# EAGLE design mainboard (EAGLE 5.04)

## Sheet 1 of 8
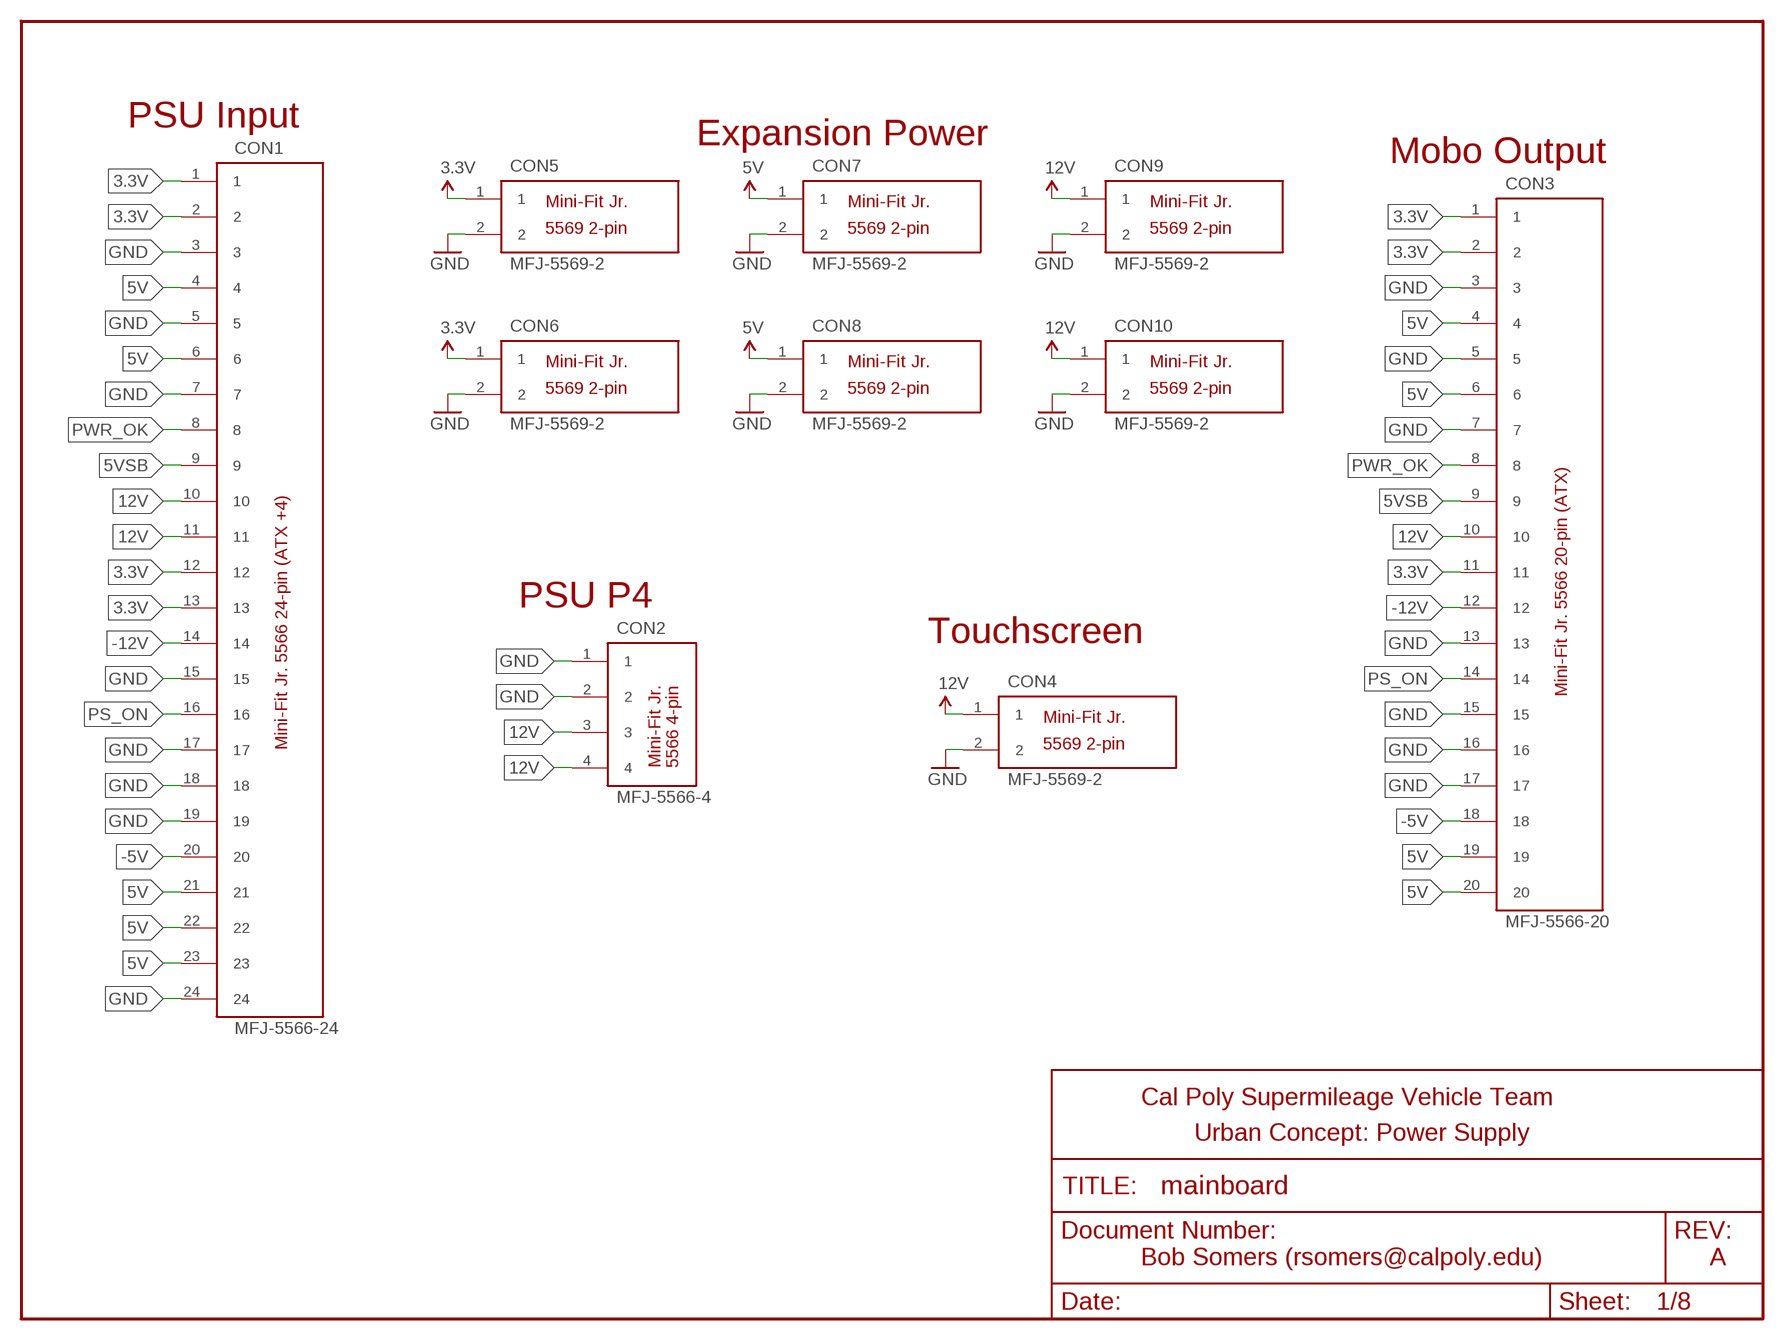
[diagram p0: schematic, sheet 1]

### Parts
CON1  MFJ-5566-24  [MFJ-5566-24]
CON2  MFJ-5566-4  [MFJ-5566-4]
CON3  MFJ-5566-20  [MFJ-5566-20]
CON4  MFJ-5569-2  [MFJ-5569-2]
CON5  MFJ-5569-2  [MFJ-5569-2]
CON6  MFJ-5569-2  [MFJ-5569-2]
CON7  MFJ-5569-2  [MFJ-5569-2]
CON8  MFJ-5569-2  [MFJ-5569-2]
CON9  MFJ-5569-2  [MFJ-5569-2]
CON10  MFJ-5569-2  [MFJ-5569-2]

### Nets
3.3V [3.3V Rail]: CON1.1 CON1.2 CON1.12 CON1.13 CON3.1 CON3.2 CON3.11 CON5.1 CON6.1 ; also sheet 2,3,4,5
5V [5V Rail]: CON1.4 CON1.6 CON1.21 CON1.22 CON1.23 CON3.4 CON3.6 CON3.19 CON3.20 CON7.1 CON8.1 ; also sheet 5
5VSB: CON1.9 CON3.9
12V [12V Rail]: CON1.10 CON1.11 CON2.3 CON2.4 CON3.10 CON4.1 CON9.1 CON10.1
-5V: CON1.20 CON3.18
-12V: CON1.14 CON3.12
GND [Ground]: CON1.3 CON1.5 CON1.7 CON1.15 CON1.17 CON1.18 CON1.19 CON1.24 CON2.1 CON2.2 CON3.3 CON3.5 CON3.7 CON3.13 CON3.15 CON3.16 CON3.17 CON4.2 CON5.2 CON6.2 CON7.2 CON8.2 CON9.2 CON10.2 ; also sheet 2,3,4,5,6
PS_ON: CON1.16 CON3.14
PWR_OK: CON1.8 CON3.8

### Notes on the sheet
- PSU Input
- Expansion Power
- Mobo Output
- PSU P4
- Touchscreen
- Cal Poly Supermileage Vehicle Team
- Urban Concept: Power Supply
- Bob Somers (rsomers@calpoly.edu) | A

## Sheet 2 of 8
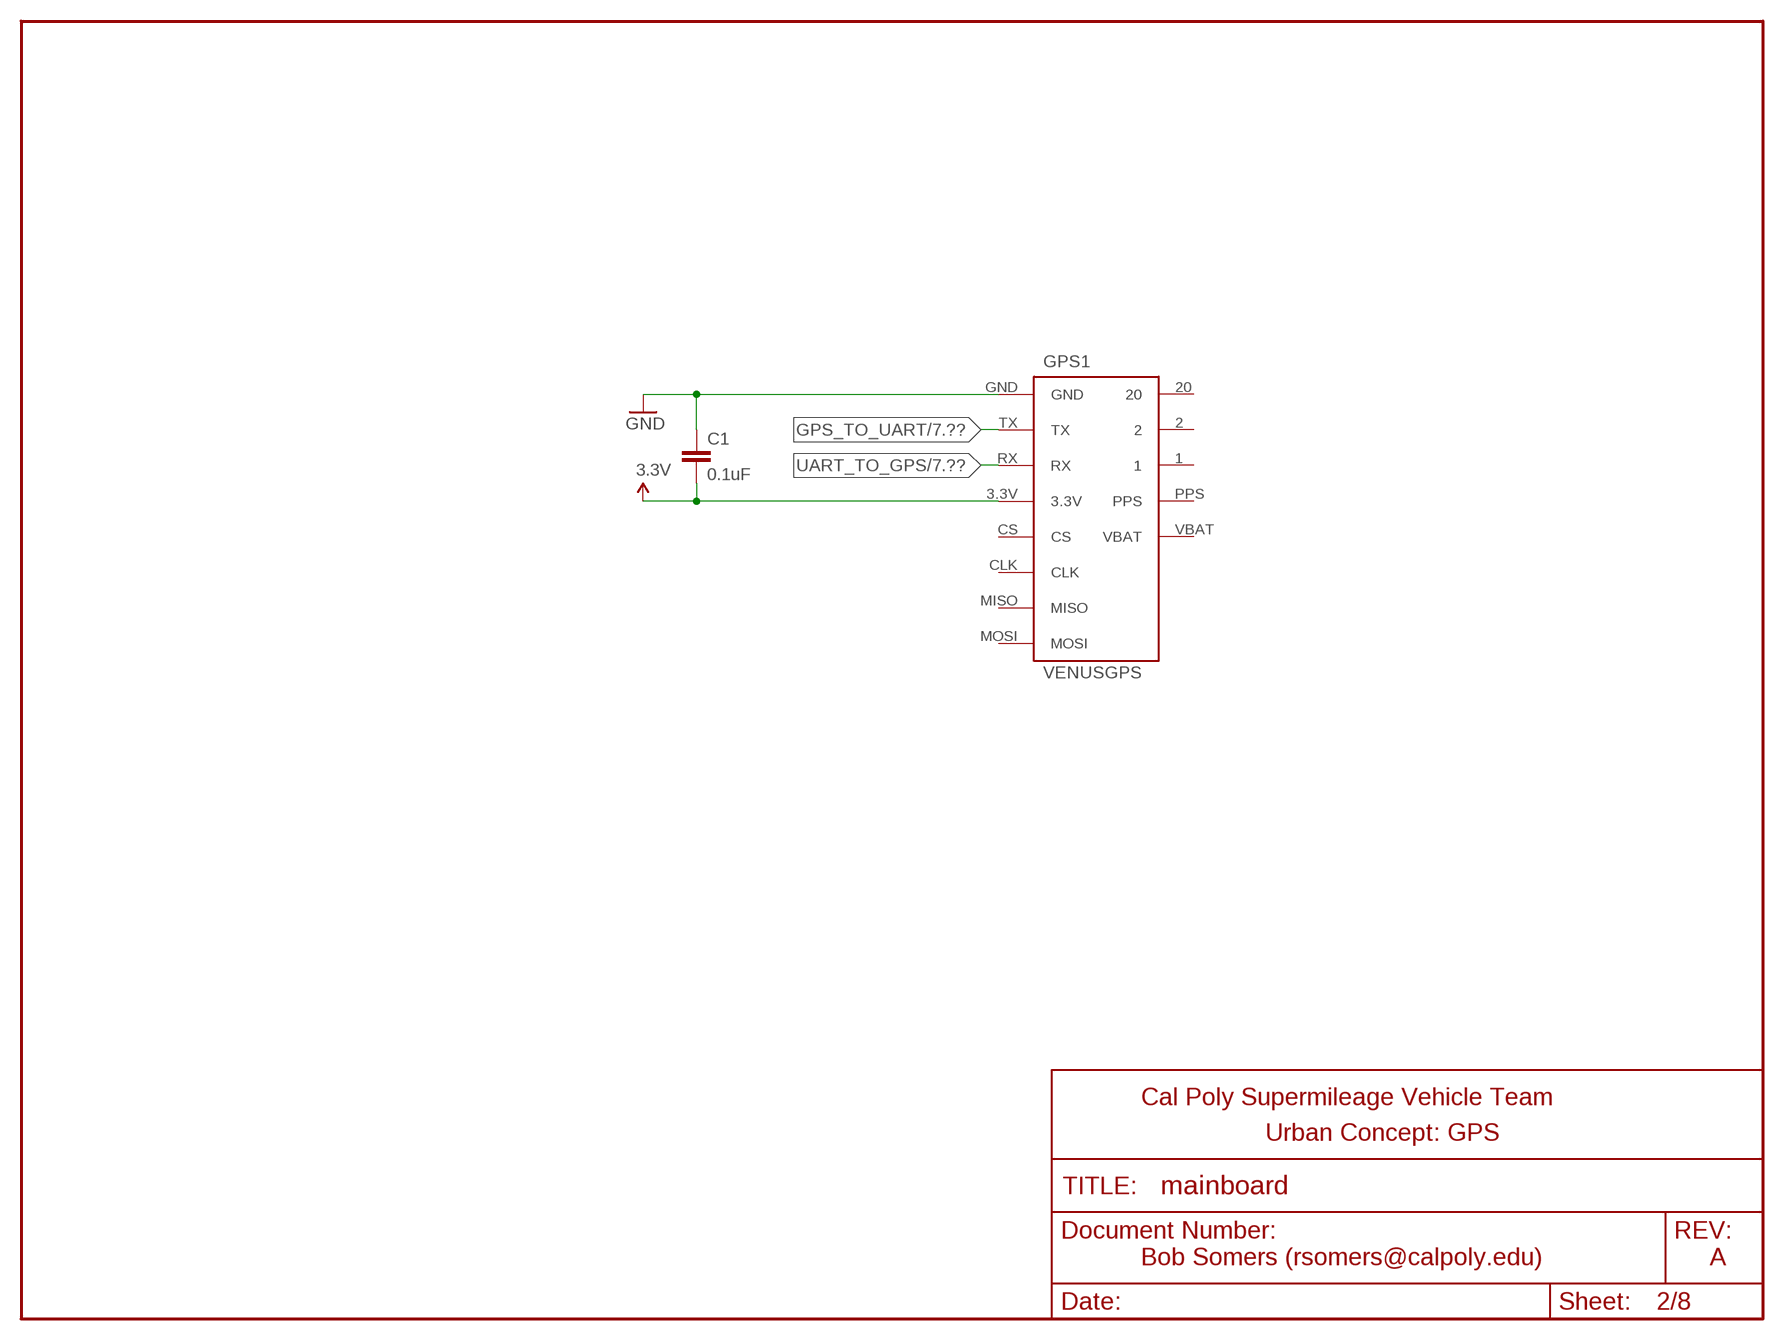
[diagram p1: schematic, sheet 2]

### Parts
C1  0.1uF  CAPPTH2  [CAP-PTH-SMALL2]
GPS1  VENUSGPS  [VENUSGPS]

### Nets
3.3V [3.3V Rail]: C1.2 GPS1.3.3V ; also sheet 1,3,4,5
GND [Ground]: C1.1 GPS1.GND ; also sheet 1,3,4,5,6
GPS_TO_UART: GPS1.TX ; also sheet 7
UART_TO_GPS: GPS1.RX ; also sheet 7
Unconnected: GPS1.1 GPS1.2 GPS1.20 GPS1.CLK GPS1.CS GPS1.MISO GPS1.MOSI GPS1.PPS GPS1.VBAT

### Notes on the sheet
- Cal Poly Supermileage Vehicle Team
- Urban Concept: GPS
- Bob Somers (rsomers@calpoly.edu) | A

## Sheet 3 of 8
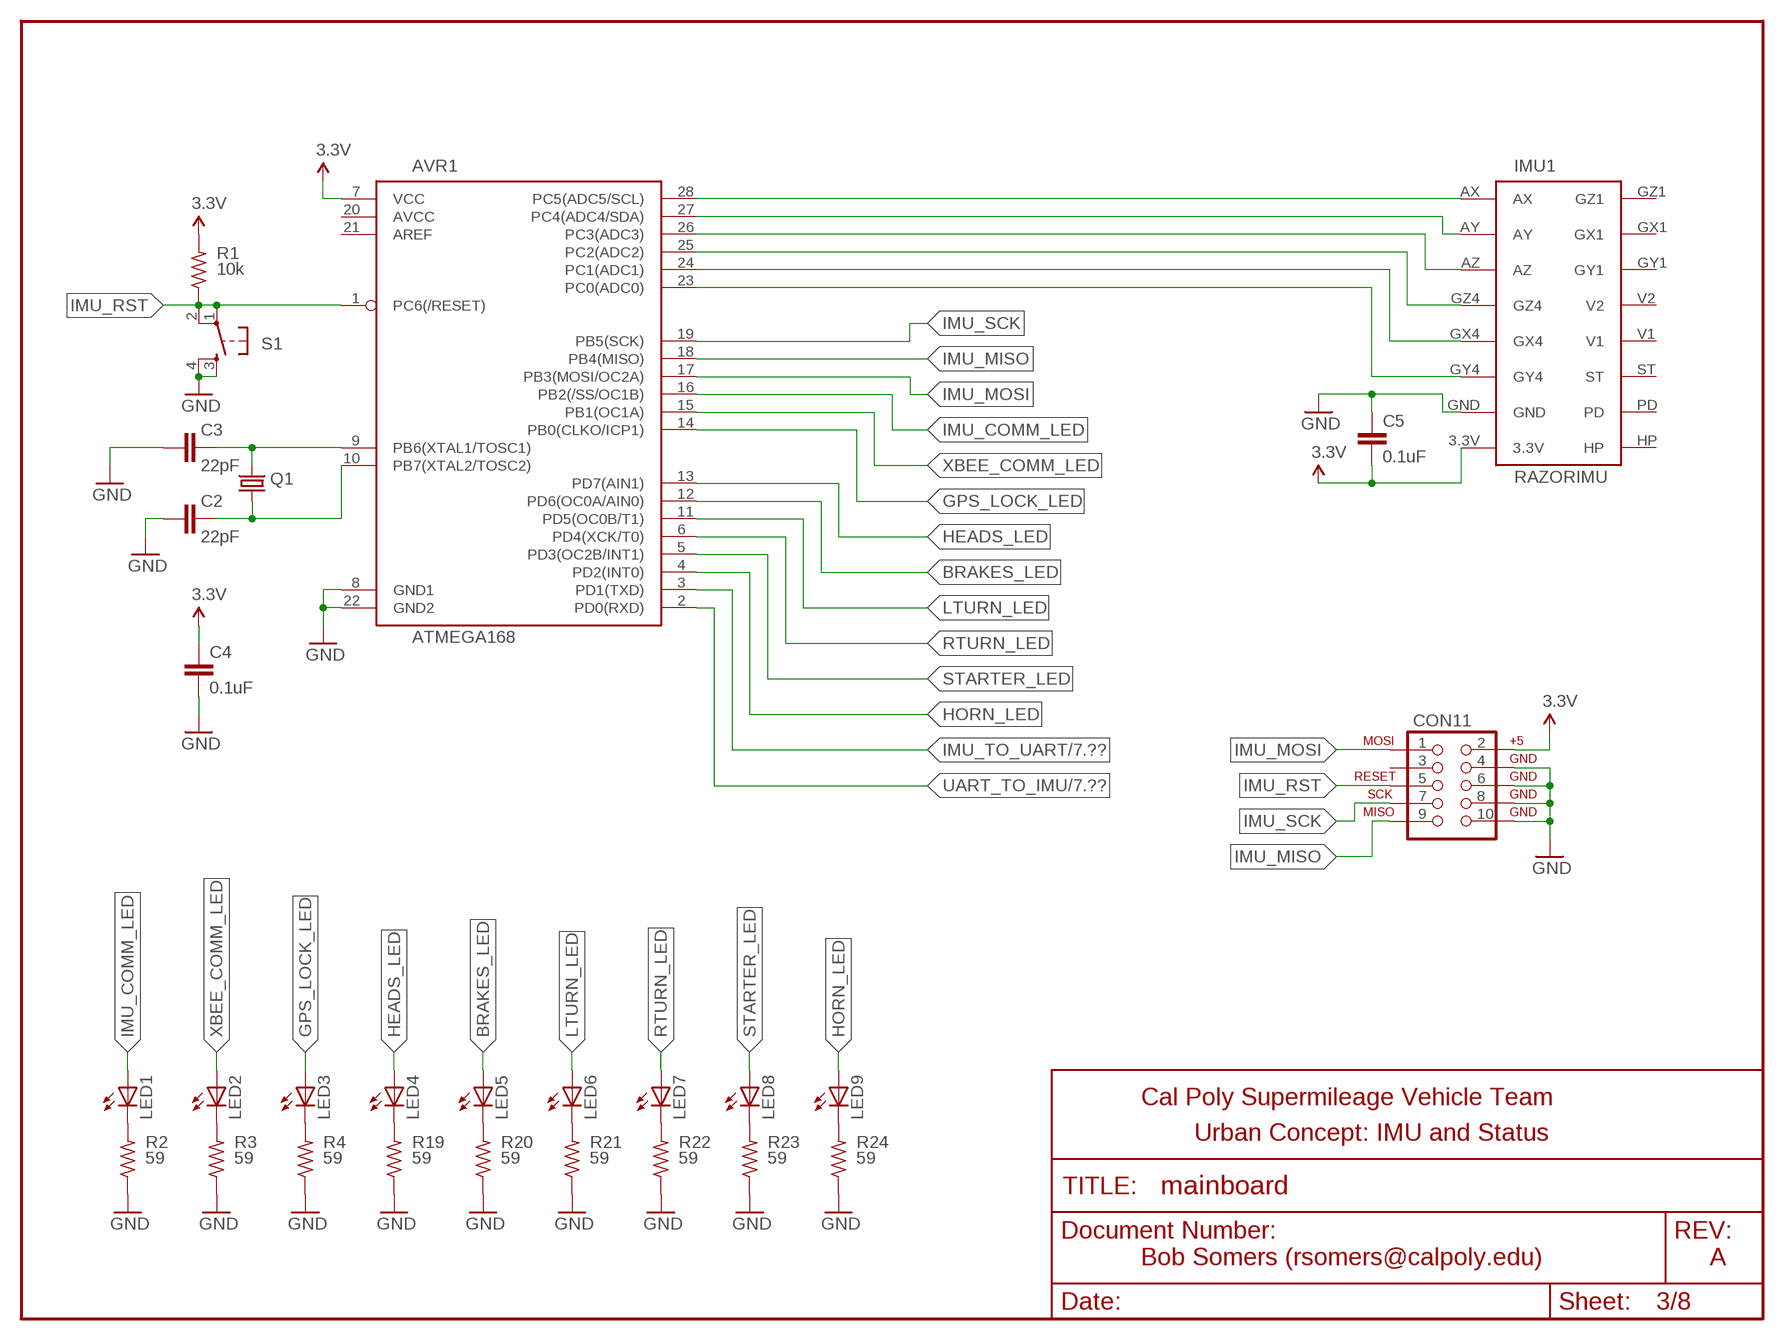
[diagram p2: schematic, sheet 3]

### Parts
AVR1  ATMEGA168  [ATMEGA168]
C2  22pF  CAPPTH2  [CAP-PTH-SMALL2]
C3  22pF  CAPPTH2  [CAP-PTH-SMALL2]
C4  0.1uF  CAPPTH2  [CAP-PTH-SMALL2]
C5  0.1uF  CAPPTH2  [CAP-PTH-SMALL2]
CON11  AVR_SPI_PROG2PTH2  [2X5-SHROUDED]
IMU1  RAZORIMU  [RAZORIMU]
LED1  LED5MM  [LED5MM]
LED2  LED5MM  [LED5MM]
LED3  LED5MM  [LED5MM]
LED4  LED5MM  [LED5MM]
LED5  LED5MM  [LED5MM]
LED6  LED5MM  [LED5MM]
LED7  LED5MM  [LED5MM]
LED8  LED5MM  [LED5MM]
LED9  LED5MM  [LED5MM]
Q1  CRYSTALHC49US  [HC49US]
R1  10k  R-US_0207/10  [0207/10]
R2  59  R-US_0207/10  [0207/10]
R3  59  R-US_0207/10  [0207/10]
R4  59  R-US_0207/10  [0207/10]
R19  59  R-US_0207/10  [0207/10]
R20  59  R-US_0207/10  [0207/10]
R21  59  R-US_0207/10  [0207/10]
R22  59  R-US_0207/10  [0207/10]
R23  59  R-US_0207/10  [0207/10]
R24  59  R-US_0207/10  [0207/10]
S1  TAC_SWITCHPTH  [TACTILE-PTH]

### Nets
3.3V [3.3V Rail]: AVR1.7(VCC) C4.1 C5.2 CON11.2 IMU1.3.3V R1.2 ; also sheet 1,2,4,5
BRAKES_LED: AVR1.12(PD6(OC0A/AIN0)) LED5.A
GND [Ground]: AVR1.8(GND1) AVR1.22(GND2) C2.1 C3.1 C4.2 C5.1 CON11.4 CON11.6 CON11.8 CON11.10 IMU1.GND R2.1 R3.1 R4.1 R19.1 R20.1 R21.1 R22.1 R23.1 R24.1 S1.3 S1.4 ; also sheet 1,2,4,5,6
GPS_LOCK_LED: AVR1.14(PB0(CLKO/ICP1)) LED3.A
HEADS_LED: AVR1.13(PD7(AIN1)) LED4.A
HORN_LED: AVR1.4(PD2(INT0)) LED9.A
IMU_COMM_LED: AVR1.16(PB2(/SS/OC1B)) LED1.A
IMU_MISO: AVR1.18(PB4(MISO)) CON11.9
IMU_MOSI: AVR1.17(PB3(MOSI/OC2A)) CON11.1
IMU_RST: AVR1.1(PC6(/RESET)) CON11.5 R1.1 S1.1 S1.2
IMU_SCK: AVR1.19(PB5(SCK)) CON11.7
IMU_TO_UART: AVR1.3(PD1(TXD)) ; also sheet 7
LTURN_LED: AVR1.11(PD5(OC0B/T1)) LED6.A
N$2: AVR1.9(PB6(XTAL1/TOSC1)) C3.2 Q1.2
N$3: AVR1.10(PB7(XTAL2/TOSC2)) C2.2 Q1.1
N$4: AVR1.28(PC5(ADC5/SCL)) IMU1.AX
N$5: AVR1.27(PC4(ADC4/SDA)) IMU1.AY
N$6: AVR1.26(PC3(ADC3)) IMU1.AZ
N$7: AVR1.25(PC2(ADC2)) IMU1.GZ4
N$8: AVR1.24(PC1(ADC1)) IMU1.GX4
N$9: AVR1.23(PC0(ADC0)) IMU1.GY4
N$12: LED3.K(C) R4.2
N$13: LED2.K(C) R3.2
N$14: LED1.K(C) R2.2
N$22: LED4.K(C) R19.2
N$23: LED5.K(C) R20.2
N$24: LED6.K(C) R21.2
N$25: LED7.K(C) R22.2
N$26: LED8.K(C) R23.2
N$27: LED9.K(C) R24.2
RTURN_LED: AVR1.6(PD4(XCK/T0)) LED7.A
STARTER_LED: AVR1.5(PD3(OC2B/INT1)) LED8.A
UART_TO_IMU: AVR1.2(PD0(RXD)) ; also sheet 7
XBEE_COMM_LED: AVR1.15(PB1(OC1A)) LED2.A
Unconnected: AVR1.20(AVCC) AVR1.21(AREF) CON11.3 IMU1.GX1 IMU1.GY1 IMU1.GZ1 IMU1.HP IMU1.PD IMU1.ST IMU1.V1 IMU1.V2

### Notes on the sheet
- Cal Poly Supermileage Vehicle Team
- Urban Concept: IMU and Status
- Bob Somers (rsomers@calpoly.edu) | A

## Sheet 4 of 8
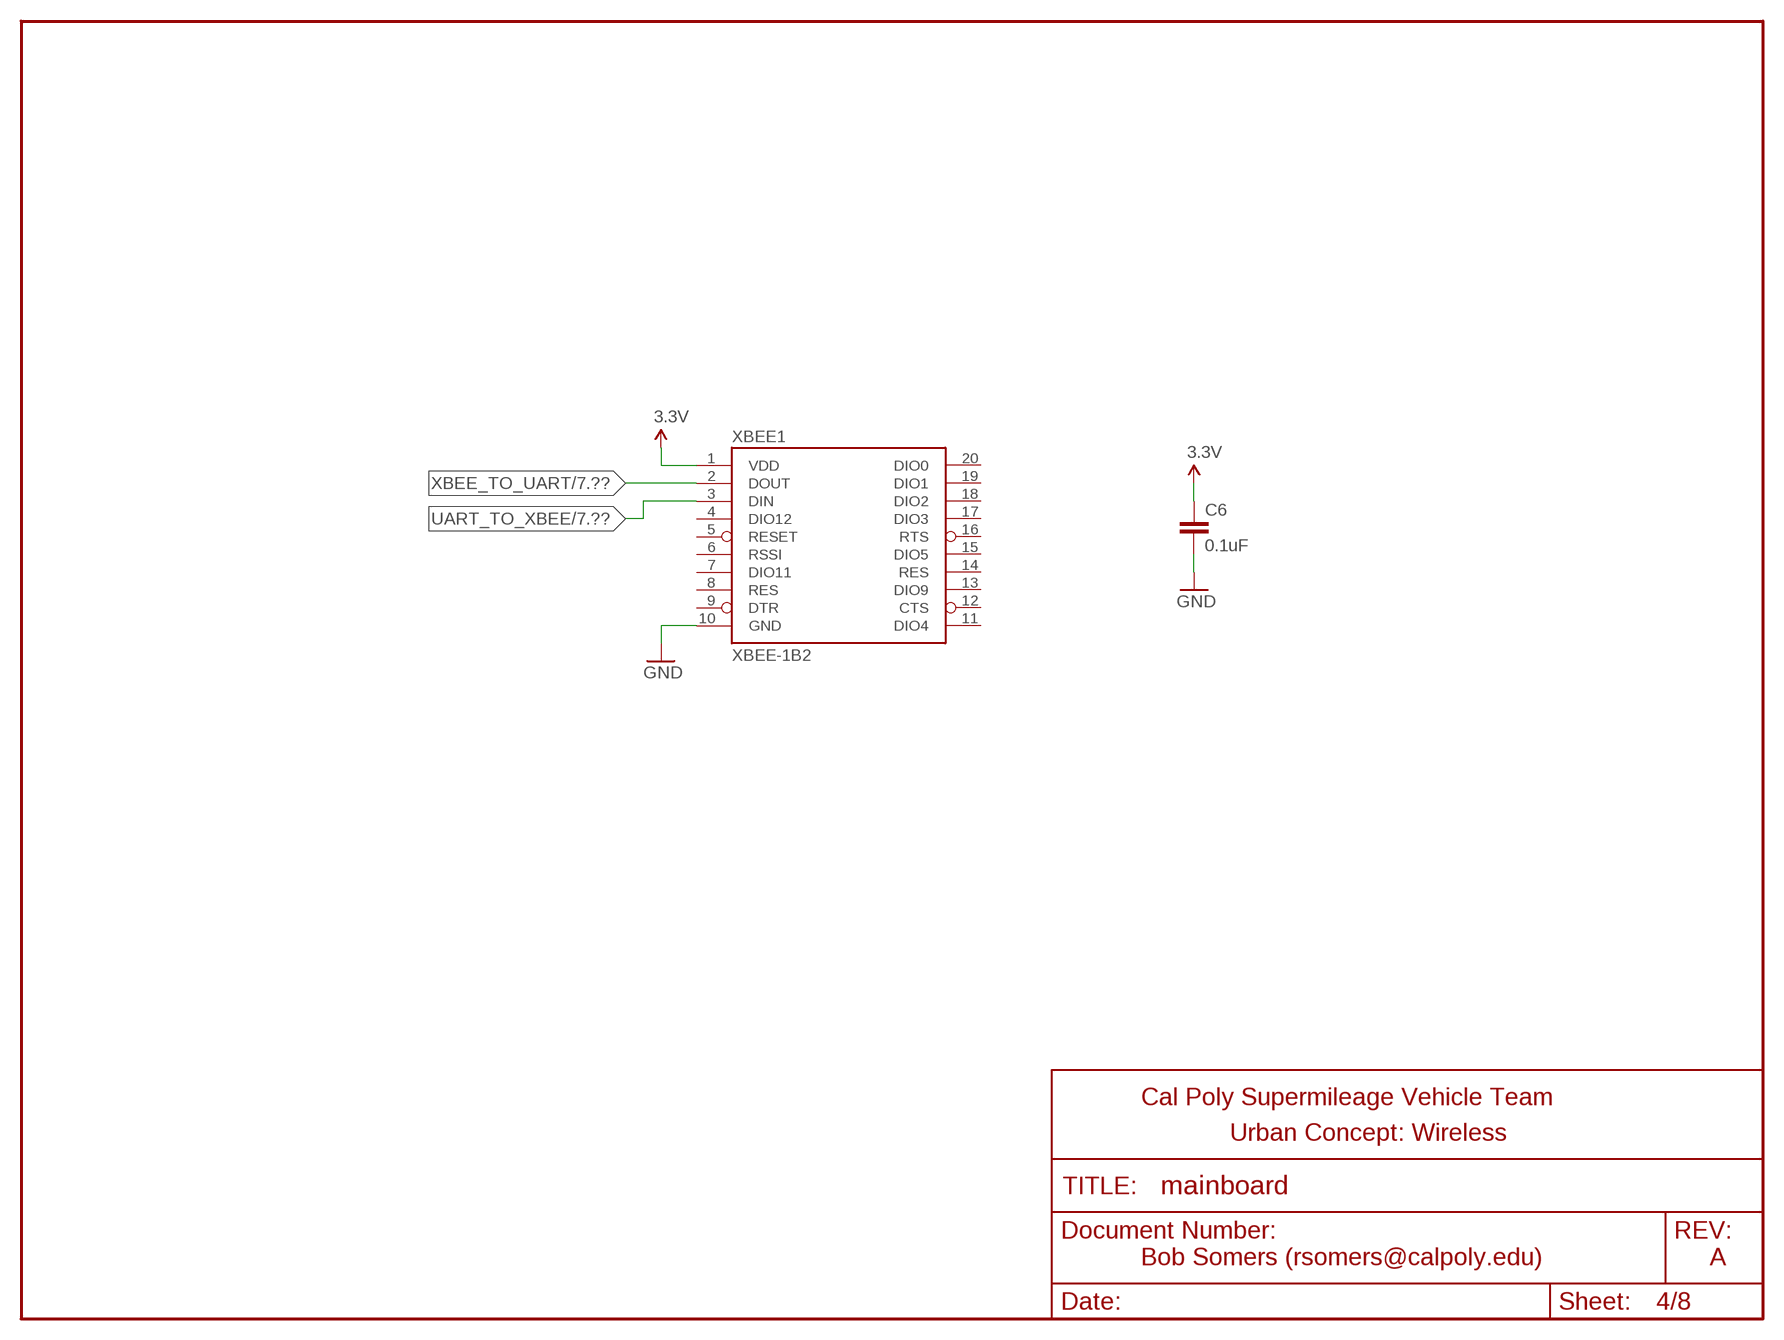
[diagram p3: schematic, sheet 4]

### Parts
C6  0.1uF  CAPPTH2  [CAP-PTH-SMALL2]
XBEE1  XBEE-1B2  [XBEE-SILK]

### Nets
3.3V [3.3V Rail]: C6.1 XBEE1.1(VDD) ; also sheet 1,2,3,5
GND [Ground]: C6.2 XBEE1.10(GND) ; also sheet 1,2,3,5,6
UART_TO_XBEE: XBEE1.3(DIN) ; also sheet 7
XBEE_TO_UART: XBEE1.2(DOUT) ; also sheet 7
Unconnected: XBEE1.4(DIO12) XBEE1.5(RESET) XBEE1.6(RSSI) XBEE1.7(DIO11) XBEE1.8(RES) XBEE1.9(DTR) XBEE1.11(DIO4) XBEE1.12(CTS) XBEE1.13(DIO9) XBEE1.14(RES) XBEE1.15(DIO5) XBEE1.16(RTS) XBEE1.17(DIO3) XBEE1.18(DIO2) XBEE1.19(DIO1) XBEE1.20(DIO0)

### Notes on the sheet
- Cal Poly Supermileage Vehicle Team
- Urban Concept: Wireless
- Bob Somers (rsomers@calpoly.edu) | A

## Sheet 5 of 8
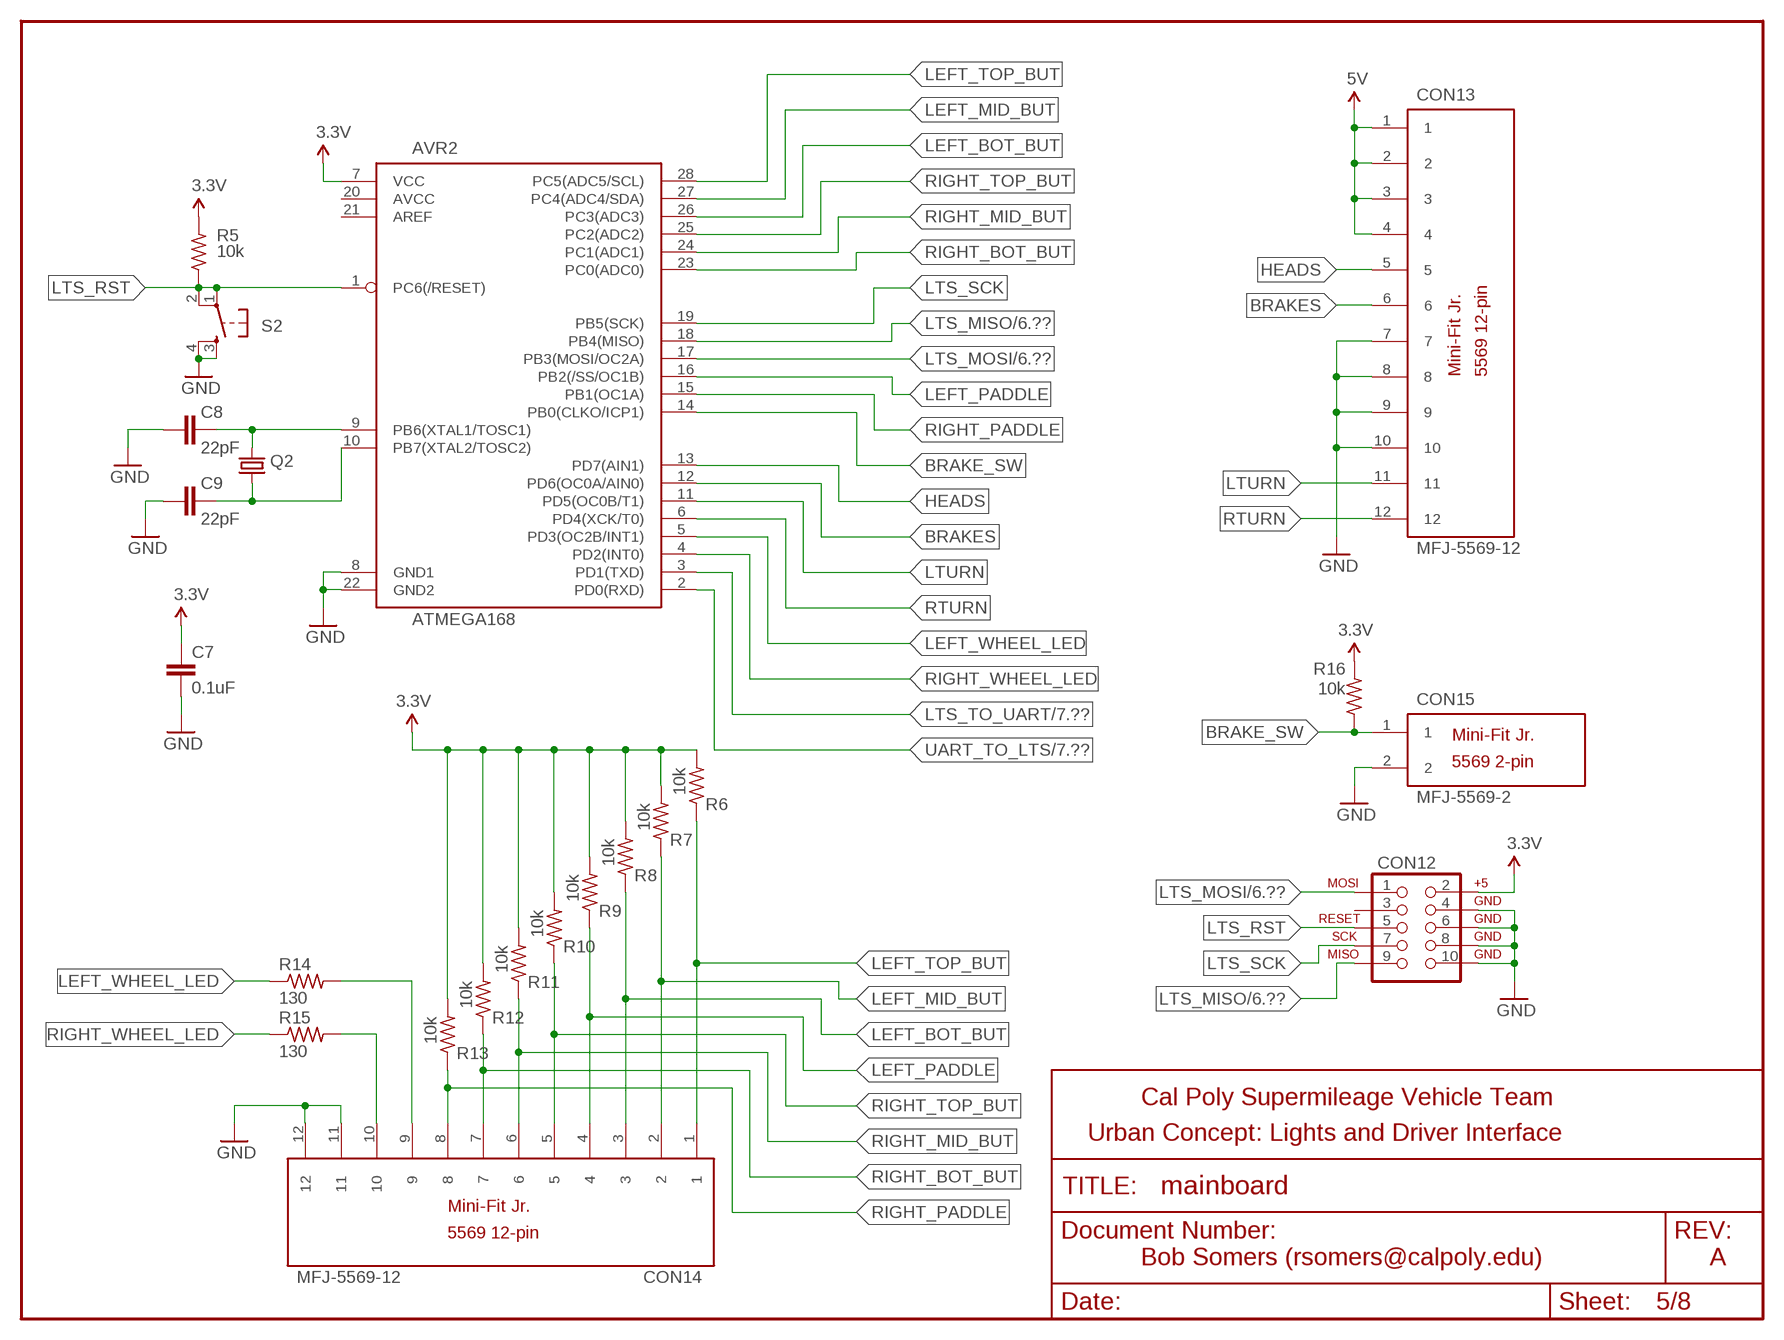
[diagram p4: schematic, sheet 5]

### Parts
AVR2  ATMEGA168  [ATMEGA168]
C7  0.1uF  CAPPTH2  [CAP-PTH-SMALL2]
C8  22pF  CAPPTH2  [CAP-PTH-SMALL2]
C9  22pF  CAPPTH2  [CAP-PTH-SMALL2]
CON12  AVR_SPI_PROG2PTH2  [2X5-SHROUDED]
CON13  MFJ-5569-12  [MFJ-5569-12]
CON14  MFJ-5569-12  [MFJ-5569-12]
CON15  MFJ-5569-2  [MFJ-5569-2]
Q2  CRYSTALHC49US  [HC49US]
R5  10k  R-US_0207/10  [0207/10]
R6  10k  R-US_0207/10  [0207/10]
R7  10k  R-US_0207/10  [0207/10]
R8  10k  R-US_0207/10  [0207/10]
R9  10k  R-US_0207/10  [0207/10]
R10  10k  R-US_0207/10  [0207/10]
R11  10k  R-US_0207/10  [0207/10]
R12  10k  R-US_0207/10  [0207/10]
R13  10k  R-US_0207/10  [0207/10]
R14  130  R-US_0207/10  [0207/10]
R15  130  R-US_0207/10  [0207/10]
R16  10k  R-US_0207/10  [0207/10]
S2  TAC_SWITCHPTH  [TACTILE-PTH]

### Nets
3.3V [3.3V Rail]: AVR2.7(VCC) C7.1 CON12.2 R5.2 R6.2 R7.2 R8.2 R9.2 R10.2 R11.2 R12.2 R13.2 R16.2 ; also sheet 1,2,3,4
5V [5V Rail]: CON13.1 CON13.2 CON13.3 CON13.4 ; also sheet 1
BRAKE_SW: AVR2.14(PB0(CLKO/ICP1)) CON15.1 R16.1
BRAKES: AVR2.12(PD6(OC0A/AIN0)) CON13.6
GND [Ground]: AVR2.8(GND1) AVR2.22(GND2) C7.2 C8.1 C9.1 CON12.4 CON12.6 CON12.8 CON12.10 CON13.7 CON13.8 CON13.9 CON13.10 CON14.11 CON14.12 CON15.2 S2.3 S2.4 ; also sheet 1,2,3,4,6
HEADS: AVR2.13(PD7(AIN1)) CON13.5
LEFT_BOT_BUT: AVR2.26(PC3(ADC3)) CON14.3 R8.1
LEFT_MID_BUT: AVR2.27(PC4(ADC4/SDA)) CON14.2 R7.1
LEFT_PADDLE: AVR2.16(PB2(/SS/OC1B)) CON14.4 R9.1
LEFT_TOP_BUT: AVR2.28(PC5(ADC5/SCL)) CON14.1 R6.1
LEFT_WHEEL_LED: AVR2.5(PD3(OC2B/INT1)) R14.1
LTS_MISO: AVR2.18(PB4(MISO)) CON12.9 ; also sheet 6
LTS_MOSI: AVR2.17(PB3(MOSI/OC2A)) CON12.1 ; also sheet 6
LTS_RST: AVR2.1(PC6(/RESET)) CON12.5 R5.1 S2.1 S2.2
LTS_SCK: AVR2.19(PB5(SCK)) CON12.7
LTS_TO_UART: AVR2.3(PD1(TXD)) ; also sheet 7
LTURN: AVR2.11(PD5(OC0B/T1)) CON13.11
N$1: CON14.9 R14.2
N$10: AVR2.9(PB6(XTAL1/TOSC1)) C8.2 Q2.2
N$11: AVR2.10(PB7(XTAL2/TOSC2)) C9.2 Q2.1
N$15: CON14.10 R15.2
RIGHT_BOT_BUT: AVR2.23(PC0(ADC0)) CON14.7 R12.1
RIGHT_MID_BUT: AVR2.24(PC1(ADC1)) CON14.6 R11.1
RIGHT_PADDLE: AVR2.15(PB1(OC1A)) CON14.8 R13.1
RIGHT_TOP_BUT: AVR2.25(PC2(ADC2)) CON14.5 R10.1
RIGHT_WHEEL_LED: AVR2.4(PD2(INT0)) R15.1
RTURN: AVR2.6(PD4(XCK/T0)) CON13.12
UART_TO_LTS: AVR2.2(PD0(RXD)) ; also sheet 7
Unconnected: AVR2.20(AVCC) AVR2.21(AREF) CON12.3

### Notes on the sheet
- Cal Poly Supermileage Vehicle Team
- Urban Concept: Lights and Driver Interface
- Bob Somers (rsomers@calpoly.edu) | A

## Sheet 6 of 8
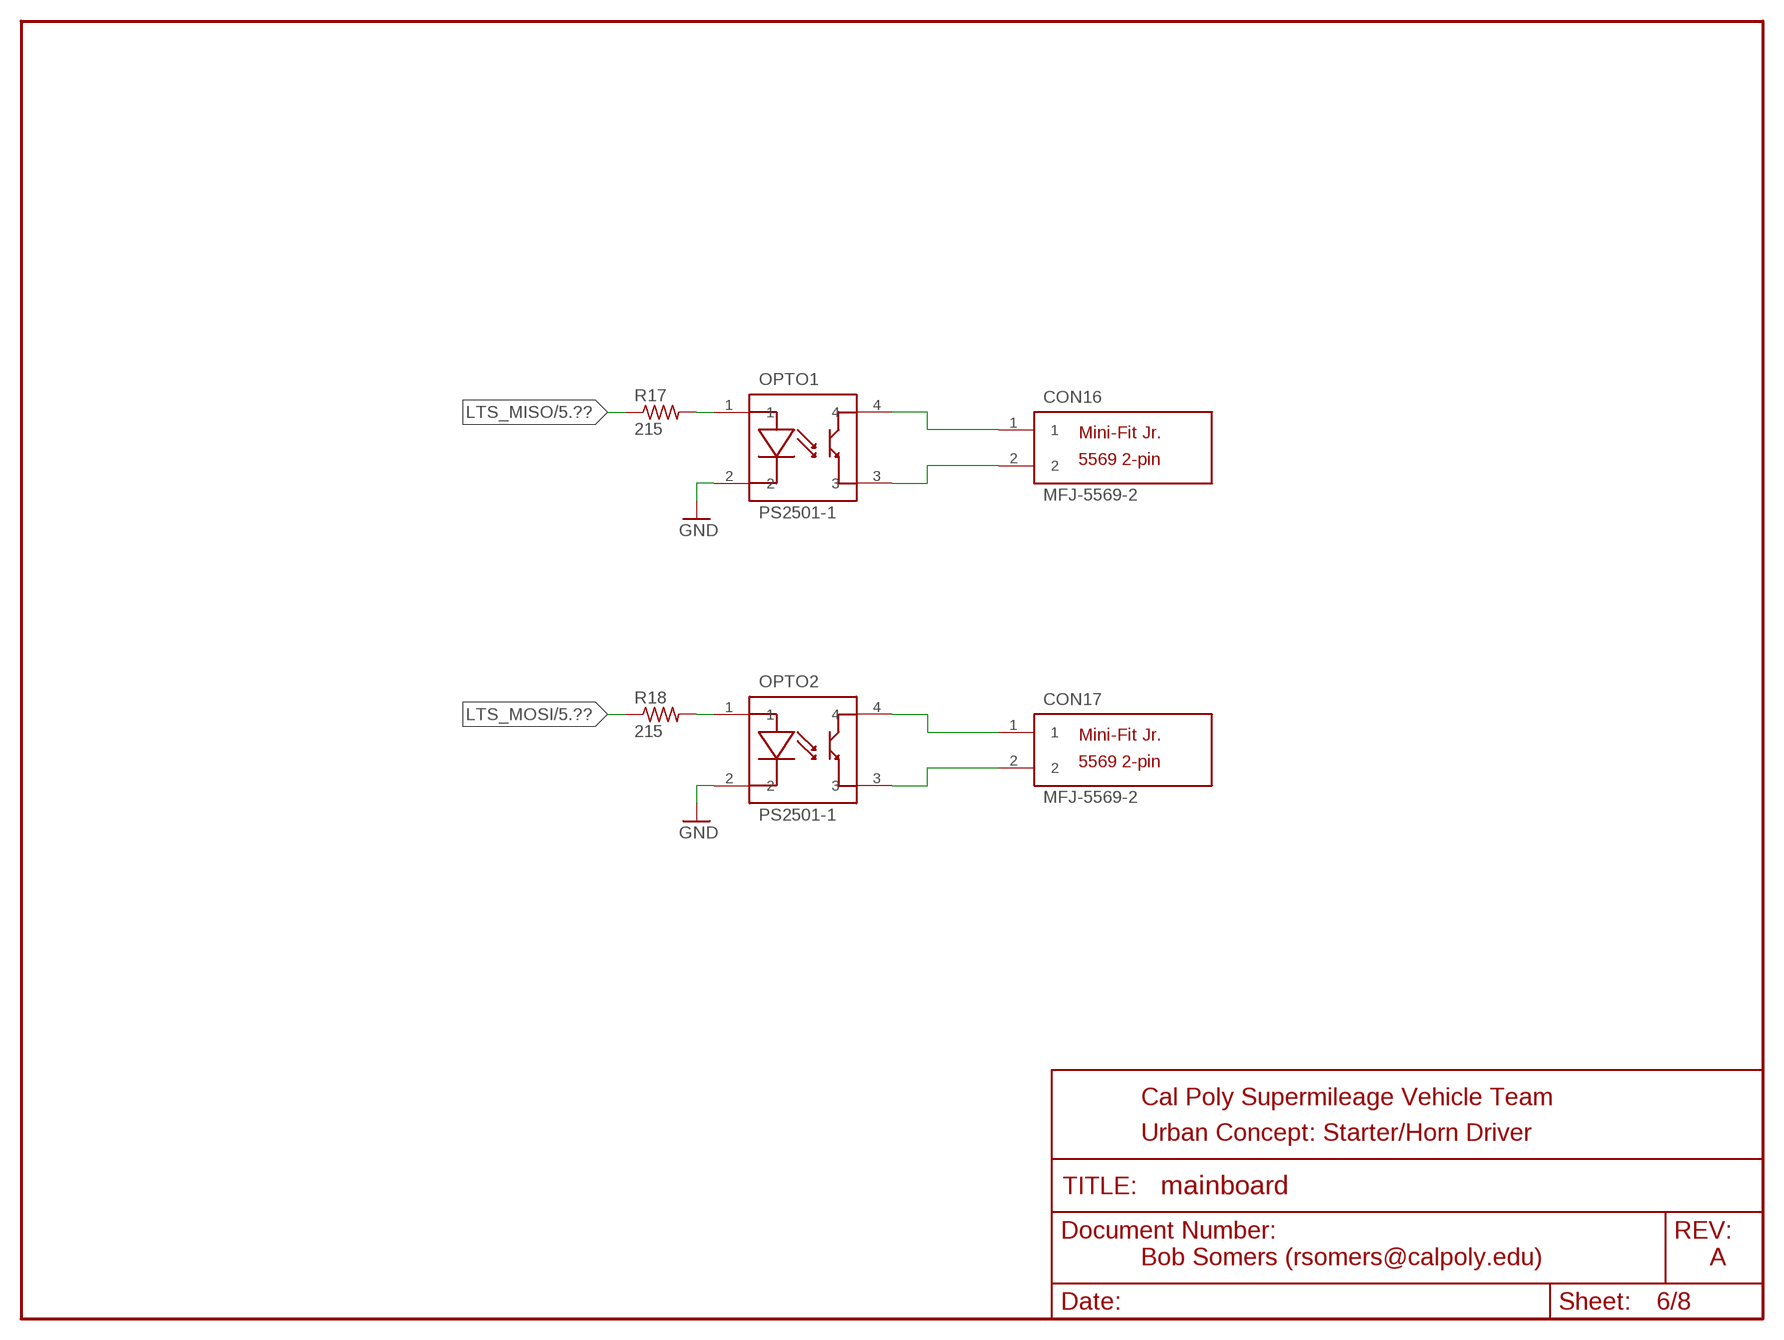
[diagram p5: schematic, sheet 6]

### Parts
CON16  MFJ-5569-2  [MFJ-5569-2]
CON17  MFJ-5569-2  [MFJ-5569-2]
OPTO1  PS2501-1  [PS2501-1]
OPTO2  PS2501-1  [PS2501-1]
R17  215  R-US_0207/10  [0207/10]
R18  215  R-US_0207/10  [0207/10]

### Nets
GND [Ground]: OPTO1.2 OPTO2.2 ; also sheet 1,2,3,4,5
LTS_MISO: R17.1 ; also sheet 5
LTS_MOSI: R18.1 ; also sheet 5
N$16: OPTO1.1 R17.2
N$17: OPTO2.1 R18.2
N$18: CON16.1 OPTO1.4
N$19: CON16.2 OPTO1.3
N$20: CON17.1 OPTO2.4
N$21: CON17.2 OPTO2.3

### Notes on the sheet
- Cal Poly Supermileage Vehicle Team
- Urban Concept: Starter/Horn Driver
- Bob Somers (rsomers@calpoly.edu) | A

## Sheet 7 of 8
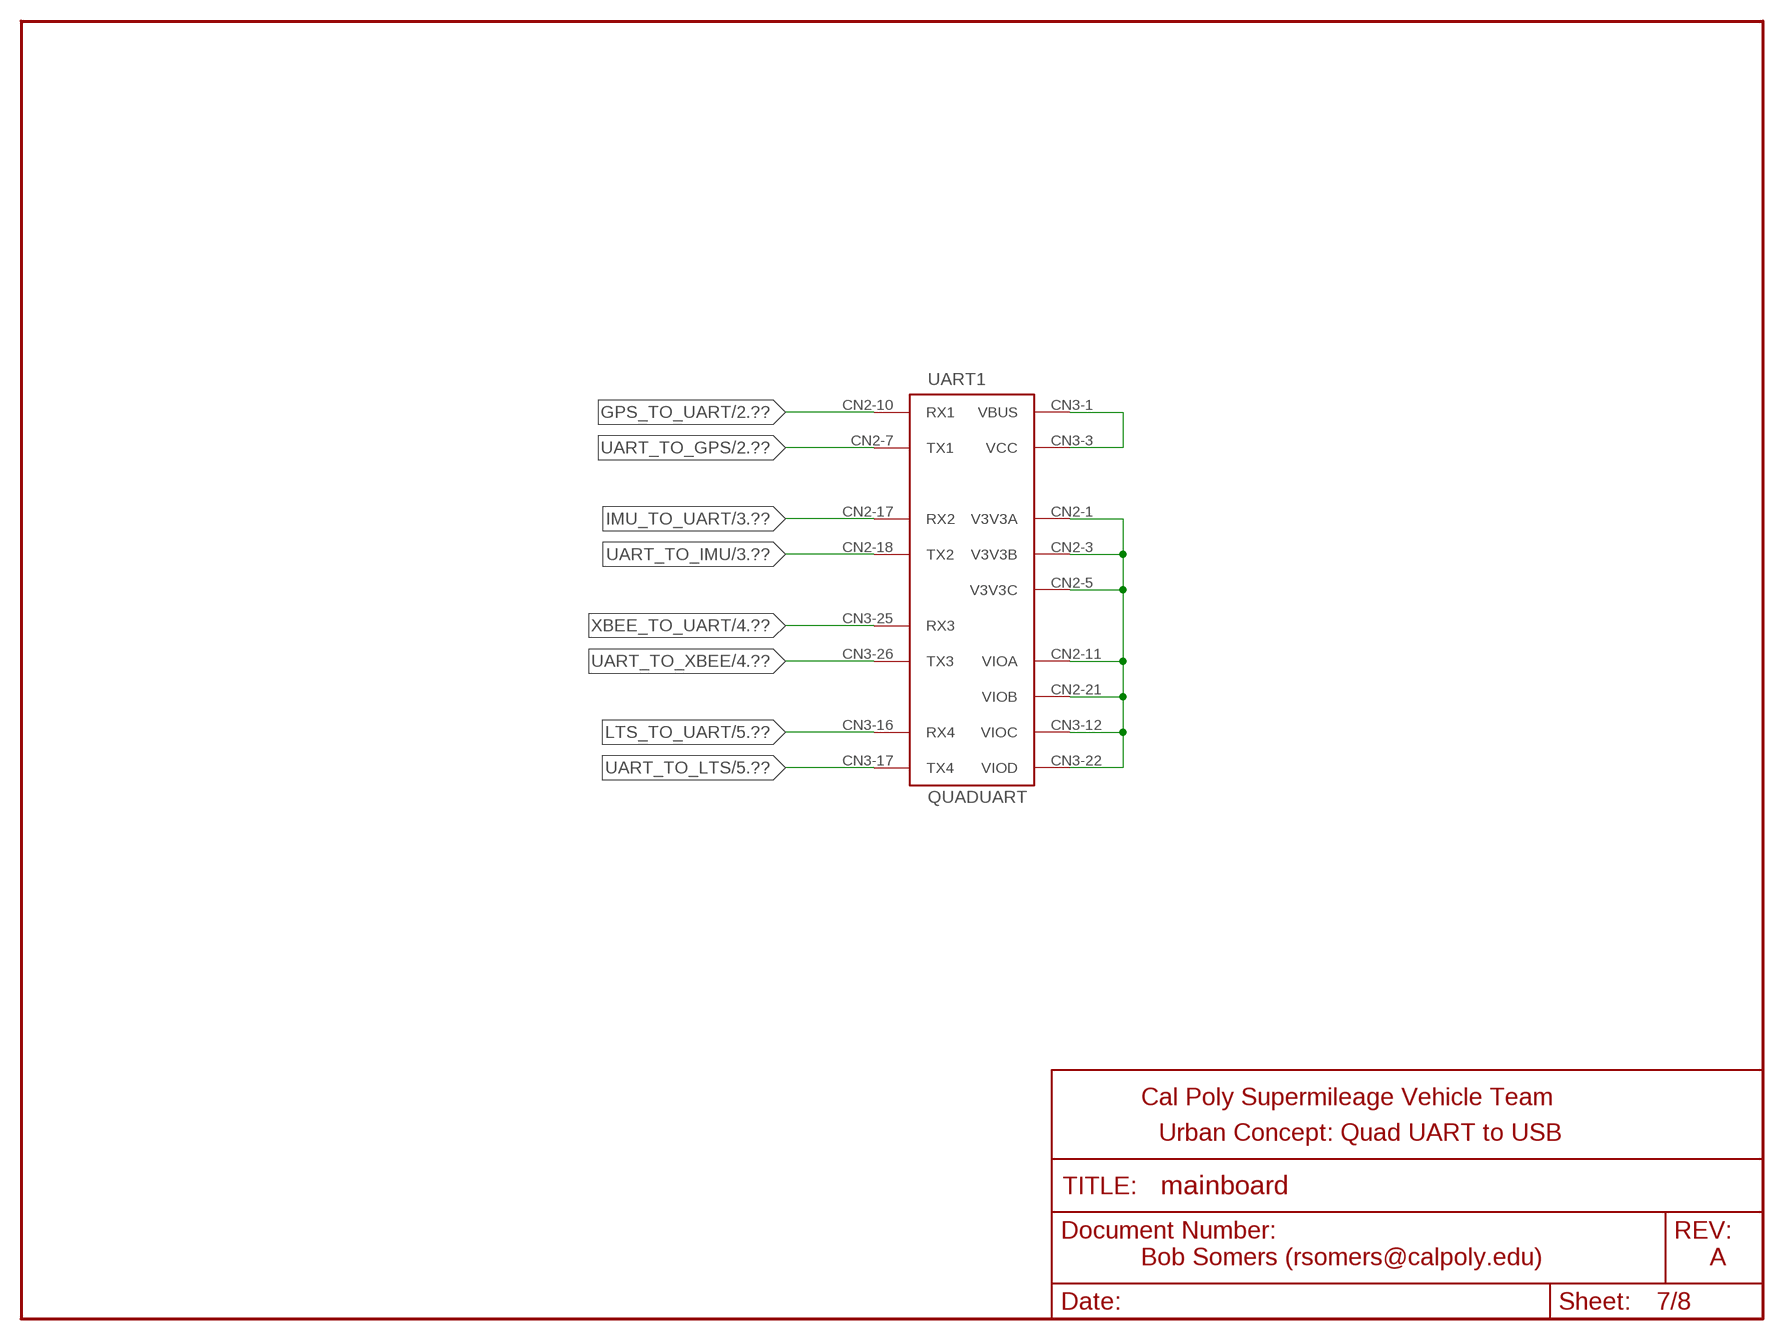
[diagram p6: schematic, sheet 7]

### Parts
UART1  QUADUART  [QUADUART]

### Nets
GPS_TO_UART: UART1.CN2-10(RX1) ; also sheet 2
IMU_TO_UART: UART1.CN2-17(RX2) ; also sheet 3
LTS_TO_UART: UART1.CN3-16(RX4) ; also sheet 5
N$28: UART1.CN3-1(VBUS) UART1.CN3-3(VCC)
N$29: UART1.CN2-1(V3V3A) UART1.CN2-3(V3V3B) UART1.CN2-5(V3V3C) UART1.CN2-11(VIOA) UART1.CN2-21(VIOB) UART1.CN3-12(VIOC) UART1.CN3-22(VIOD)
UART_TO_GPS: UART1.CN2-7(TX1) ; also sheet 2
UART_TO_IMU: UART1.CN2-18(TX2) ; also sheet 3
UART_TO_LTS: UART1.CN3-17(TX4) ; also sheet 5
UART_TO_XBEE: UART1.CN3-26(TX3) ; also sheet 4
XBEE_TO_UART: UART1.CN3-25(RX3) ; also sheet 4

### Notes on the sheet
- Cal Poly Supermileage Vehicle Team
- Urban Concept: Quad UART to USB
- Bob Somers (rsomers@calpoly.edu) | A

## Sheet 8 of 8
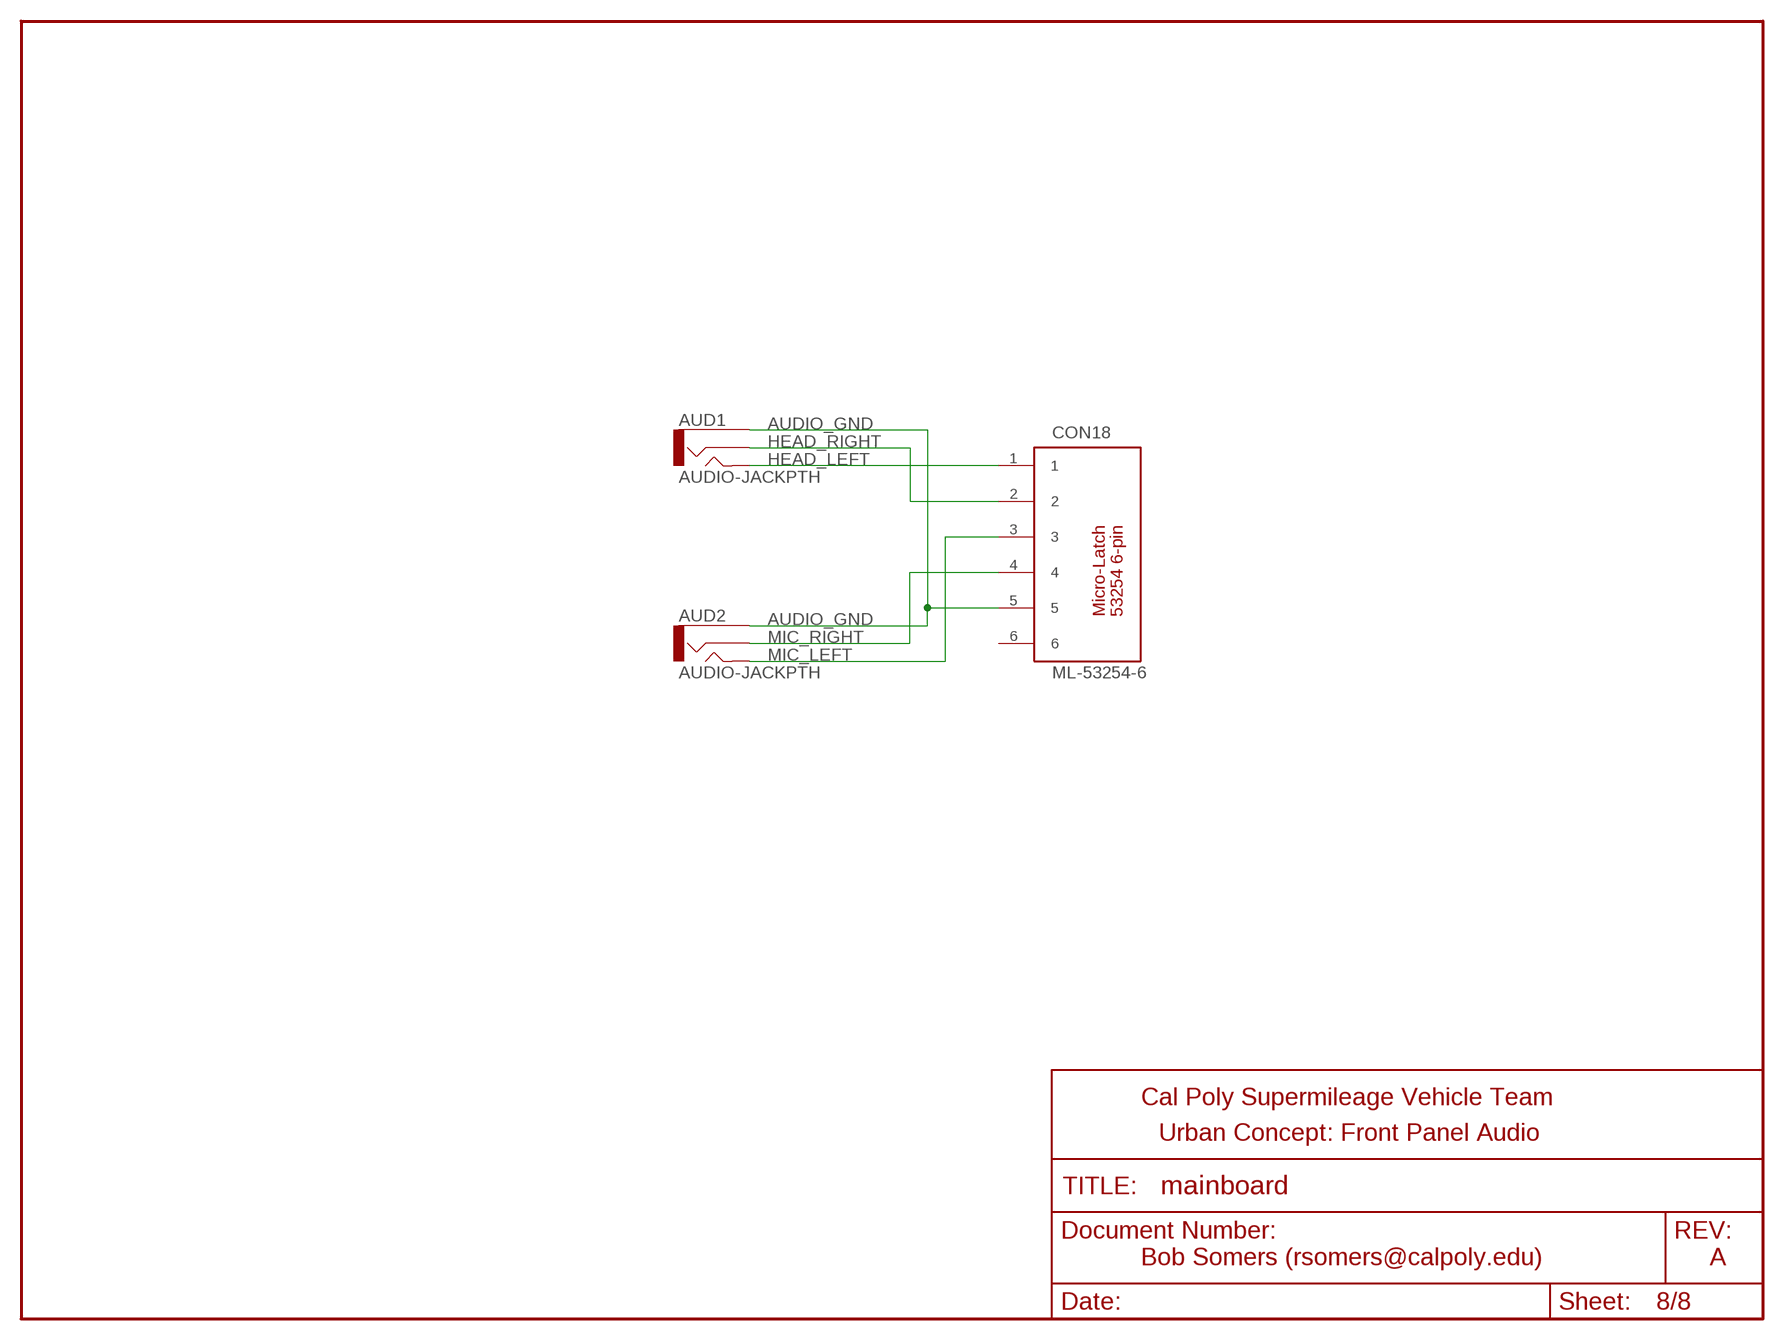
[diagram p7: schematic, sheet 8]

### Parts
AUD1  AUDIO-JACKPTH  [AUDIO-JACK]
AUD2  AUDIO-JACKPTH  [AUDIO-JACK]
CON18  ML-53254-6  [ML-53254-6]

### Nets
AUDIO_GND: AUD1.1 AUD2.1 CON18.5
HEAD_LEFT: AUD1.5 CON18.1
HEAD_RIGHT: AUD1.2 CON18.2
MIC_LEFT: AUD2.5 CON18.3
MIC_RIGHT: AUD2.2 CON18.4
Unconnected: CON18.6

### Notes on the sheet
- Cal Poly Supermileage Vehicle Team
- Urban Concept: Front Panel Audio
- Bob Somers (rsomers@calpoly.edu) | A

## Library data of the parts
AUD1 AUD2 = SparkFun:AUDIO-JACK: 3.5mm Audio Jack Simple 3.5mm common PCB mount audio jack. SKU: PRT-08032
AVR1 AVR2 = CalPolyUCV:ATMEGA168
C1-C9 = SparkFun:CAP: Capacitor Standard 0603 ceramic capacitor, and 0.1" leaded capacitor.
CON1 = CalPolyUCV:MFJ-5566-24
CON2 = CalPolyUCV:MFJ-5566-4
CON3 = CalPolyUCV:MFJ-5566-20
CON4-CON10 CON15-CON17 = CalPolyUCV:MFJ-5569-2
CON11 CON12 = SparkFun:AVR_SPI_PROG2: AVR ICSP Header This is the standard AVR In Circuit Serial Programming header. Minimal, but includes pin one indicator. Works with standard Olimex programmers. Also look for the 6-pin reduced version. Spark Fun Electronics SKU: PRT-00778
CON13 CON14 = CalPolyUCV:MFJ-5569-12
CON18 = CalPolyUCV:ML-53254-6
GPS1 = CalPolyUCV:VENUSGPS
IMU1 = CalPolyUCV:RAZORIMU
LED1-LED9 = led:LED: LED OSRAM: - CHIPLED LG R971, LG N971, LY N971, LG Q971, LY Q971, LO R971, LY R971 LH N974, LH R974 LS Q976, LO Q976, LY Q976 LO Q996 - Hyper CHIPLED LW Q18S LB Q993, LB Q99A, LB R99A - SideLED LS A670, LO A670, LY A670, LG A670, LP A670 LB A673, LV A673, LT A673, LW A673 LH A674 LY A675 LS A676, LA A676, LO A676, LY A676, LW A676 LS A679, LY A679, LG A679 - Hyper Micro SIDELED® LS Y876, LA Y876, LO Y876, LY Y876 LT Y87S - SmartLED LW L88C, LW L88S LB L89C, LB L89S, LG L890 LS L89K, LO L89K, LY L89K LS L896, LA L896, LO L896, LY L896 - TOPLED LS T670, LO T670, LY T670, LG T670, LP T670 LSG T670, LSP T670, LSY T670, LOP T670, LYG T670 LG T671, LOG T671, LSG T671 LB T673, LV T673, LT T673, LW T673 LH T674 LS T676, LA T676, LO T676, LY T676, LB T676, LH T676, LSB T676, LW T676 LB T67C, LV T67C, LT T67C, LS T67K, LO T67K, LY T67K, LW E67C LS E67B, LA E67B, LO E67B, LY E67B, LB E67C, LV E67C, LT E67C LW T67C LS T679, LY T679, LG T679 LS T770, LO T770, LY T770, LG T770, LP T770 LB T773, LV T773, LT T773, LW T773 LH T774 LS E675, LA E675, LY E675, LS T675 LS T776, LA T776, LO T776, LY T776, LB T776 LHGB T686 LT T68C, LB T68C - Hyper Mini TOPLED® LB M676 - Mini TOPLED Santana® LG M470 LS M47K, LO M47K, LY M47K Source: http://www.osram.convergy.de LUXEON: - LUMILED® LXK2-PW12-R00, LXK2-PW12-S00, LXK2-PW14-U00, LXK2-PW14-V00 LXK2-PM12-R00, LXK2-PM12-S00, LXK2-PM14-U00 LXK2-PE12-Q00, LXK2-PE12-R00, LXK2-PE12-S00, LXK2-PE14-T00, LXK2-PE14-U00 LXK2-PB12-K00, LXK2-PB12-L00, LXK2-PB12-M00, LXK2-PB14-N00, LXK2-PB14-P00, LXK2-PB14-Q00 LXK2-PR12-L00, LXK2-PR12-M00, LXK2-PR14-Q00, LXK2-PR14-R00 LXK2-PD12-Q00, LXK2-PD12-R00, LXK2-PD12-S00 LXK2-PH12-R00, LXK2-PH12-S00 LXK2-PL12-P00, LXK2-PL12-Q00, LXK2-PL12-R00 Source: www.luxeon.com KINGBRIGHT: KA-3528ASYC Source: www.kingbright.com
OPTO1 OPTO2 = CalPolyUCV:PS2501-1
Q1 Q2 = SparkFun:CRYSTAL: Crystals Various standard crystals. Proven footprints. Spark Fun Electronics SKU : COM-00534
R1-R24 = rcl:R-US_: RESISTOR, American symbol
S1 S2 = SparkFun:TAC_SWITCH: Momentary Switch Button commonly used for reset or general input. Spark Fun Electronics SKU : COM-00097
UART1 = CalPolyUCV:QUADUART
XBEE1 = SparkFun:XBEE-1

## Net classes
0 Signal: width 0.381 mm
1 3.3V Rail: width 1.27 mm
2 5V Rail: width 1.27 mm
3 12V Rail: width 1.27 mm
4 Ground: width 1.27 mm

## Board
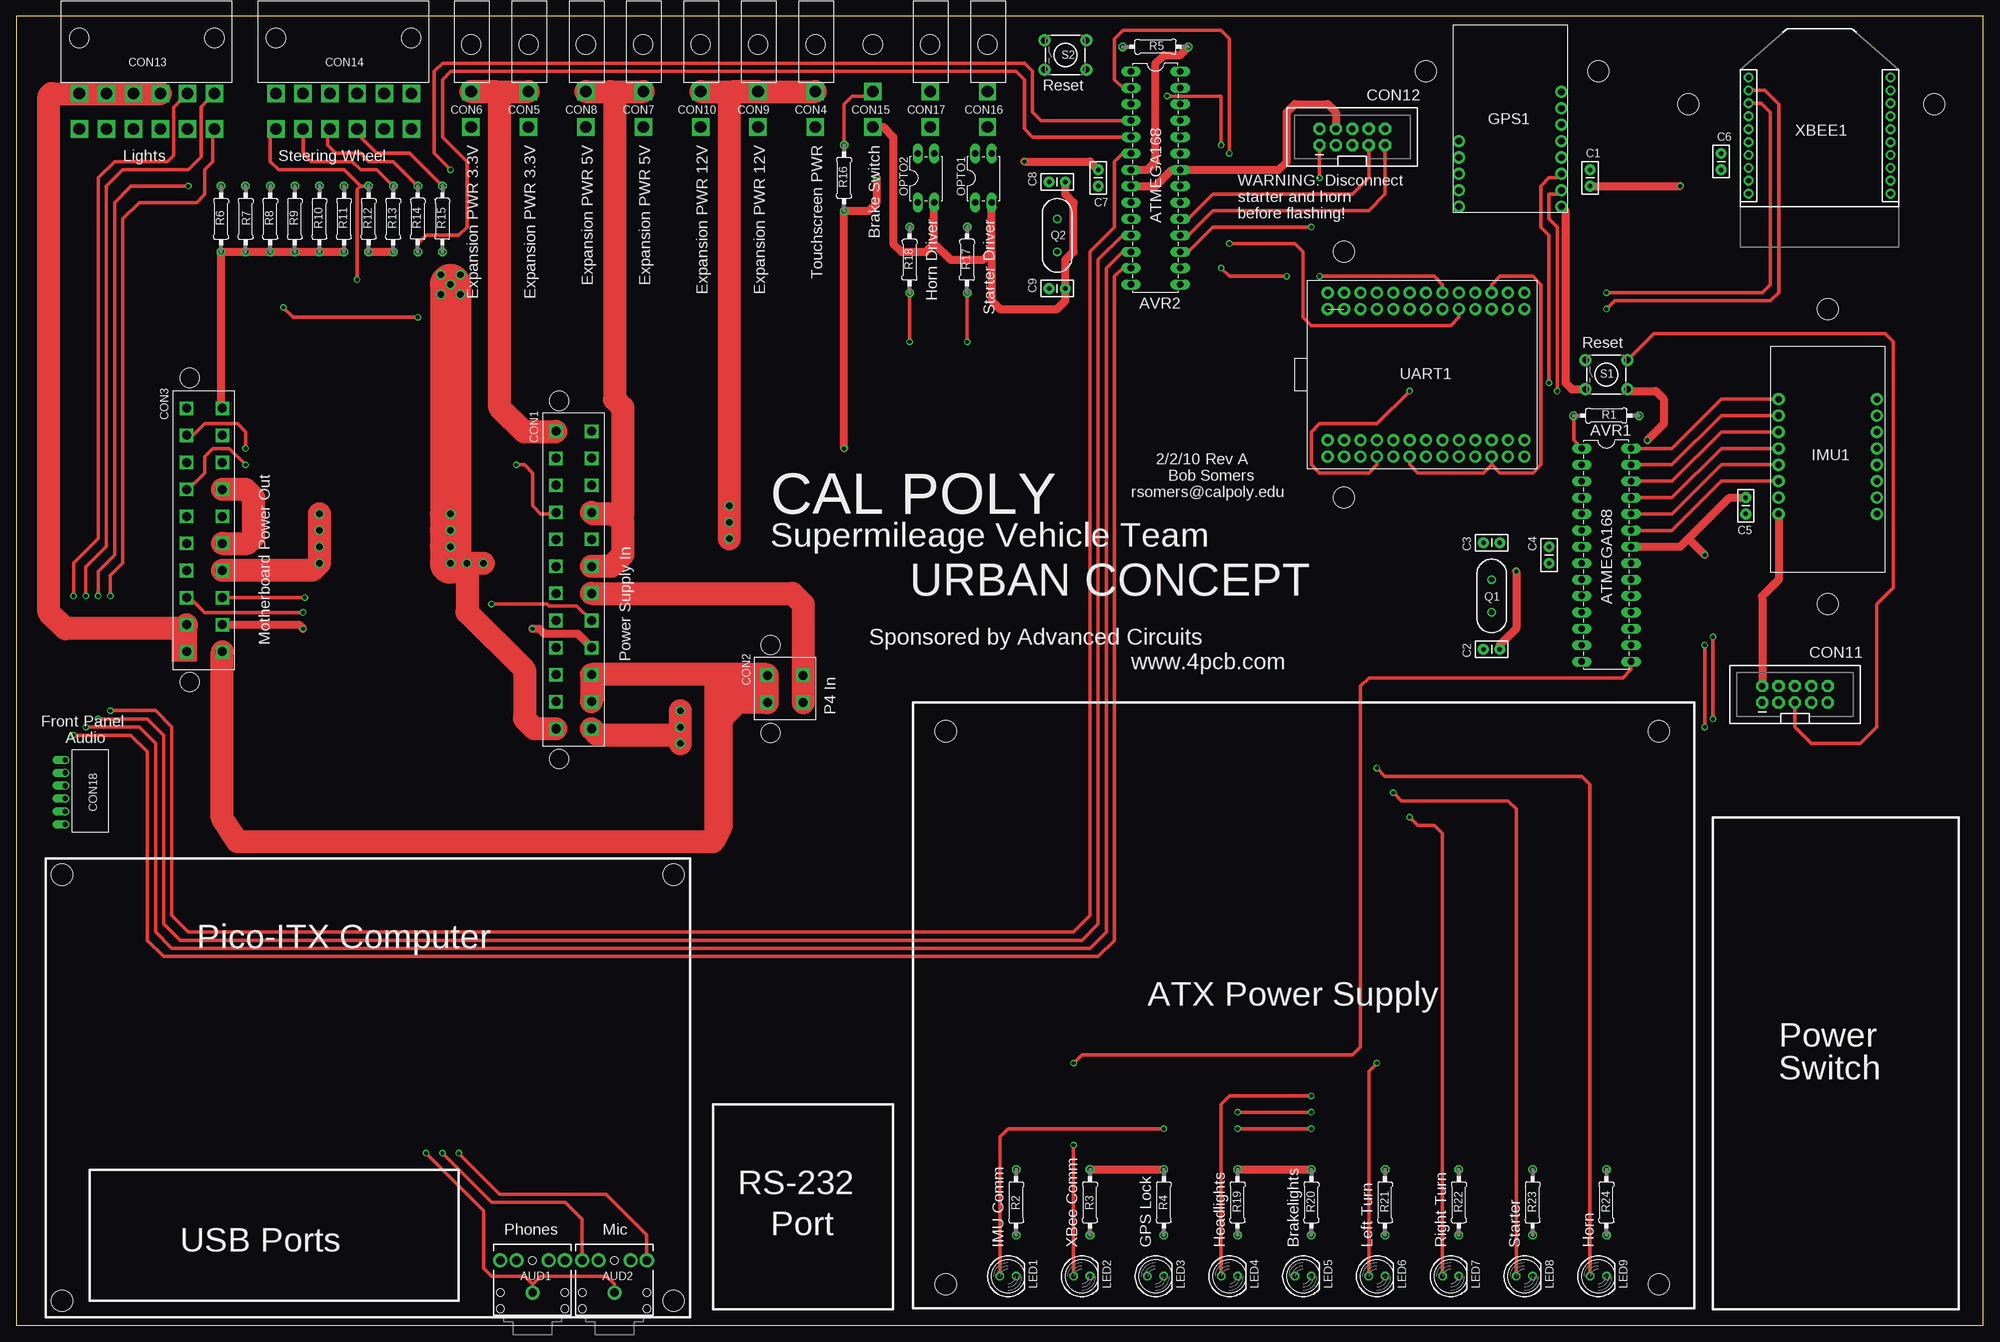
[diagram p8: board, top side]
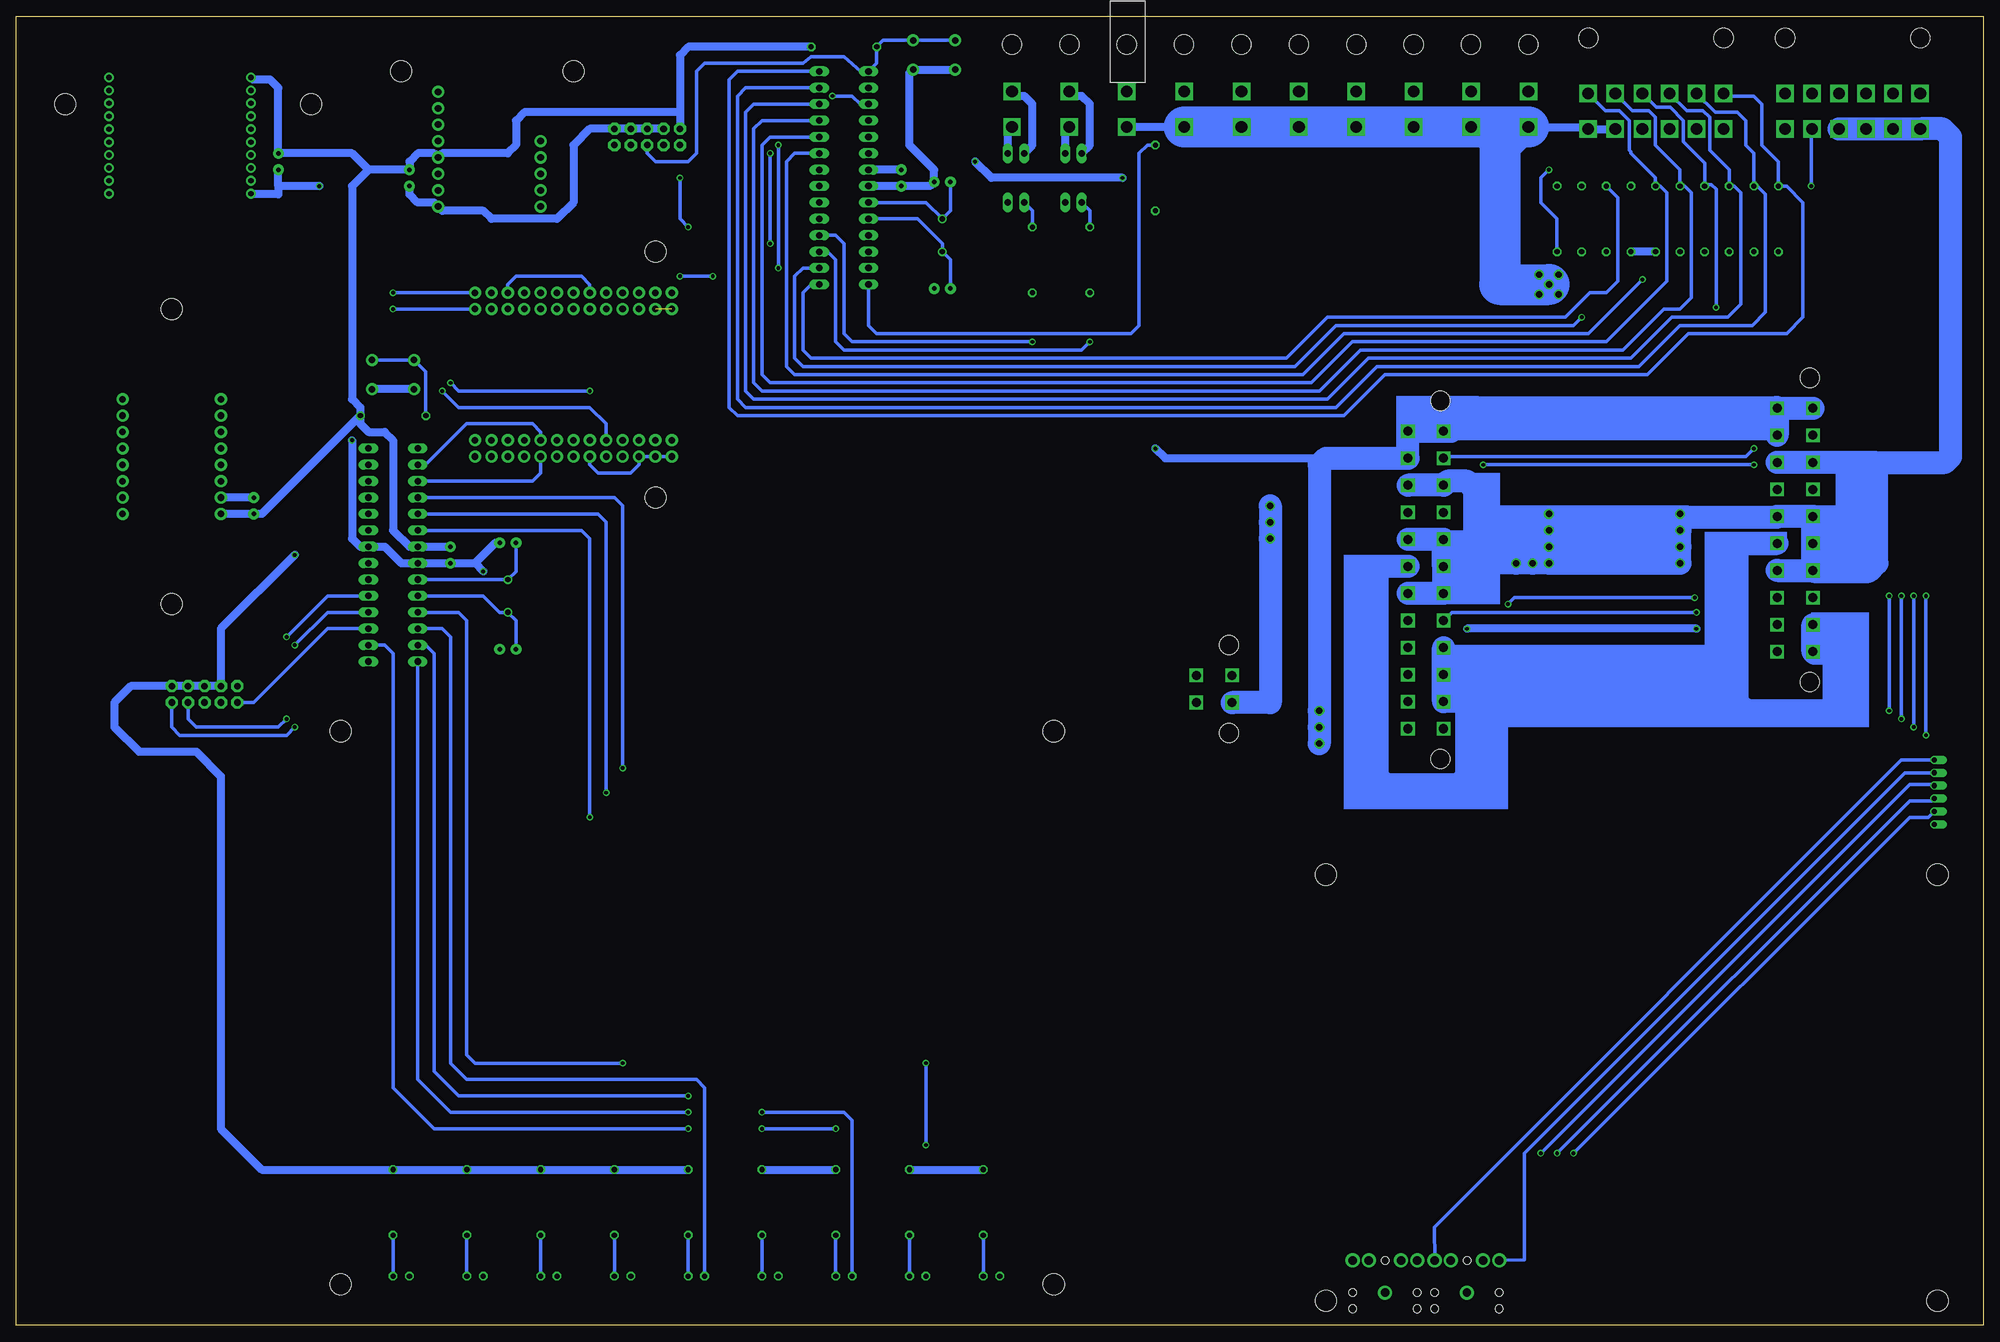
[diagram p9: board, bottom side, seen from below]

Size 304.78 x 202.87 mm. Coordinates in mm from the lower left corner, seen from the top.
Outline: 0,0 304.78,0 304.78,202.87 0,202.87 0,0
Copper layers (1*16): Top 0.035mm / dielectric 1.5mm / Bottom 0.035mm
Design rules "default *": minimum track width 10mil, minimum drill 15mil, track to track 8mil, track to pad 8mil, pad to pad 8mil, via to via 8mil, smd to smd 8mil, copper to edge 40mil, drill to drill 8mil, minimum pad ring 10mil, minimum via ring 8mil, stop-mask expansion 4mil, vias tented up to drill 0mil, thermal gap 10mil

### Footprints (pad centres in the part's own frame; a part is rotated, then mirrored left to right if it is on the bottom)
AUDIO-JACK = drill 1.3 pad 2.184 round: 1 0,0; 2 5,5; 3 5,2.5; 4 5,-2.5; 5 5,-5 | hole 1.2: 0,5; -2.5,5; -2.5,-5; 0,-5; 5,0
ATMEGA168 = drill 1.016 long: 1 -16.51,-3.81; 2 -13.97,-3.81; 3 -11.43,-3.81; 4 -8.89,-3.81; 5 -6.35,-3.81; 6 -3.81,-3.81; 7 -1.27,-3.81; 8 1.27,-3.81; 9 3.81,-3.81; 10 6.35,-3.81; 11 8.89,-3.81; 12 11.43,-3.81; 13 13.97,-3.81; 14 16.51,-3.81; 15 16.51,3.81; 16 13.97,3.81; 17 11.43,3.81; 18 8.89,3.81; 19 6.35,3.81; 20 3.81,3.81; 21 1.27,3.81; 22 -1.27,3.81; 23 -3.81,3.81; 24 -6.35,3.81; 25 -8.89,3.81; 26 -11.43,3.81; 27 -13.97,3.81; 28 -16.51,3.81
CAP-PTH-SMALL2 = drill 0.7 pad 1.651 round: 1 0,0; 2 2.54,0
MFJ-5566-24 = drill 1.397 square: 1 22.987,-2.794; 2 18.796,-2.794; 3 14.605,-2.794; 4 10.414,-2.794; 5 6.223,-2.794; 6 2.032,-2.794; 7 -2.159,-2.794; 8 -6.35,-2.794; 9 -10.541,-2.794; 10 -14.732,-2.794; 11 -18.923,-2.794; 12 -23.114,-2.794; 13 22.987,2.718; 14 18.796,2.718; 15 14.605,2.718; 16 10.414,2.718; 17 6.223,2.718; 18 2.032,2.718; 19 -2.159,2.718; 20 -6.35,2.718; 21 -10.541,2.718; 22 -14.732,2.718; 23 -18.923,2.718; 24 -23.114,2.718 | hole 2.997: -27.813,2.261; 27.686,2.261
MFJ-5566-4 = drill 1.397 square: 1 4.191,0; 2 0,0; 3 4.191,5.512; 4 0,5.512 | hole 2.997: -4.699,5.055; 8.89,5.055
MFJ-5566-20 = drill 1.397 square: 1 18.923,-2.718; 2 14.732,-2.718; 3 10.541,-2.718; 4 6.35,-2.718; 5 2.159,-2.718; 6 -2.032,-2.718; 7 -6.223,-2.718; 8 -10.414,-2.718; 9 -14.605,-2.718; 10 -18.796,-2.718; 11 18.923,2.794; 12 14.732,2.794; 13 10.541,2.794; 14 6.35,2.794; 15 2.159,2.794; 16 -2.032,2.794; 17 -6.223,2.794; 18 -10.414,2.794; 19 -14.605,2.794; 20 -18.796,2.794 | hole 2.997: 23.622,2.337; -23.495,2.337
MFJ-5569-2 = drill 1.803 square: 1 0,3.124; 2 0,8.636 | hole 2.997: 0,-4.166
2X5-SHROUDED = drill 1.016 pad 1.88 octagon: 1 -1.27,5.08; 2 1.27,5.08; 3 -1.27,2.54; 4 1.27,2.54; 5 -1.27,0; 6 1.27,0; 7 -1.27,-2.54; 8 1.27,-2.54; 9 -1.27,-5.08; 10 1.27,-5.08
MFJ-5569-12 = drill 1.803 square: 1 10.541,3.429; 2 6.35,3.429; 3 2.159,3.429; 4 -2.032,3.429; 5 -6.223,3.429; 6 -10.414,3.429; 7 10.541,8.941; 8 6.35,8.941; 9 2.159,8.941; 10 -2.032,8.941; 11 -6.223,8.941; 12 -10.414,8.941 | hole 2.997: -10.414,-5.182; 10.541,-5.182
ML-53254-6 = drill 0.8 offset: 1 -5.08,-3.81; 2 -3.08,-3.81; 3 -1.08,-3.81; 4 0.92,-3.81; 5 2.92,-3.81; 6 4.92,-3.81
VENUSGPS = drill 1.016 pad 1.88 round: 1 -8.255,7.62; 2 -10.795,7.62; 3.3V -5.715,-8.255; 20 -13.335,7.62; CLK -0.635,-8.255; CS -3.175,-8.255; GND -13.335,-8.255; MISO 1.905,-8.255; MOSI 4.445,-8.255; PPS -5.715,7.62; RX -8.255,-8.255; TX -10.795,-8.255; VBAT -3.175,7.62
RAZORIMU = drill 1.016 pad 1.88 round: 3.3V 8.89,-7.62; AX -8.89,-7.62; AY -6.35,-7.62; AZ -3.81,-7.62; GND 6.35,-7.62; GX1 -6.35,7.62; GX4 1.27,-7.62; GY1 -3.81,7.62; GY4 3.81,-7.62; GZ1 -8.89,7.62; GZ4 -1.27,-7.62; HP 8.89,7.62; PD 6.35,7.62; ST 3.81,7.62; V1 1.27,7.62; V2 -1.27,7.62
LED5MM = drill 0.813 octagon: A -1.27,0; K 1.27,0
PS2501-1 = drill 1.016 long: 1 -2.54,-3.81; 2 0,-3.81; 3 0,3.81; 4 -2.54,3.81
HC49US = drill 0.813 round: 1 -2.54,0; 2 2.54,0
0207/10 = drill 0.813 octagon: 1 -5.08,0; 2 5.08,0
TACTILE-PTH = drill 1.016 pad 1.88 round: 1 -3.251,2.261; 2 3.251,2.261; 3 -3.251,-2.261; 4 3.251,-2.261
STAND-OFF = hole 3.302: 0,0
QUADUART = drill 1.016 pad 1.88 round: CN2-1 -15.24,-12.7; CN2-2 -15.24,-10.16; CN2-3 -12.7,-12.7; CN2-4 -12.7,-10.16; CN2-5 -10.16,-12.7; CN2-6 -10.16,-10.16; CN2-7 -7.62,-12.7; CN2-8 -7.62,-10.16; CN2-9 -5.08,-12.7; CN2-10 -5.08,-10.16; CN2-11 -2.54,-12.7; CN2-12 -2.54,-10.16; CN2-13 0,-12.7; CN2-14 0,-10.16; CN2-15 2.54,-12.7; CN2-16 2.54,-10.16; CN2-17 5.08,-12.7; CN2-18 5.08,-10.16; CN2-19 7.62,-12.7; CN2-20 7.62,-10.16; CN2-21 10.16,-12.7; CN2-22 10.16,-10.16; CN2-23 12.7,-12.7; CN2-24 12.7,-10.16; CN2-25 15.24,-12.7; CN2-26 15.24,-10.16; CN3-1 -15.24,10.16; CN3-2 -15.24,12.7; CN3-3 -12.7,10.16; CN3-4 -12.7,12.7; CN3-5 -10.16,10.16; CN3-6 -10.16,12.7; CN3-7 -7.62,10.16; CN3-8 -7.62,12.7; CN3-9 -5.08,10.16; CN3-10 -5.08,12.7; CN3-11 -2.54,10.16; CN3-12 -2.54,12.7; CN3-13 0,10.16; CN3-14 0,12.7; CN3-15 2.54,10.16; CN3-16 2.54,12.7; CN3-17 5.08,10.16; CN3-18 5.08,12.7; CN3-19 7.62,10.16; CN3-20 7.62,12.7; CN3-21 10.16,10.16; CN3-22 10.16,12.7; CN3-23 12.7,10.16; CN3-24 12.7,12.7; CN3-25 15.24,10.16; CN3-26 15.24,12.7
XBEE-SILK = drill 0.8 pad 1.524 round: 1 -11,20; 2 -11,18; 3 -11,16; 4 -11,14; 5 -11,12; 6 -11,10; 7 -11,8; 8 -11,6; 9 -11,4; 10 -11,2; 11 11,2; 12 11,4; 13 11,6; 14 11,8; 15 11,10; 16 11,12; 17 11,14; 18 11,16; 19 11,18; 20 11,20

### Placement (x,y rotation side)
AUD1  80.01,5.08 90 top
AUD2  92.71,5.08 90 top
AVR1  246.38,119.38 270 top
AVR2  176.53,177.8 270 top
C1  243.84,176.53 90 top
C2  229.87,104.78 180 top
C3  229.87,121.28 180 top
C4  237.49,120.65 270 top
C5  267.97,128.27 270 top
C6  264.16,181.61 270 top
C7  167.64,179.07 270 top
C8  162.56,177.16 180 top
C9  162.56,160.66 180 top
CON1  86.36,115.57 90 top
CON2  121.92,96.52 90 top
CON3  29.21,123.19 90 top
CON4  123.83,194.31 180 top
CON5  79.38,194.31 180 top
CON6  70.48,194.31 180 top
CON7  97.16,194.31 180 top
CON8  88.27,194.31 180 top
CON9  114.94,194.31 180 top
CON10  106.05,194.31 180 top
CON11  275.59,97.79 90 top
CON12  207.01,184.15 90 top
CON13  20.32,194.31 180 top
CON14  50.8,194.31 180 top
CON15  132.72,194.31 180 bottom
CON16  150.5,194.31 180 top
CON17  141.6,194.31 180 top
CON18  11.43,82.55 270 top
GPS1  231.14,186.69 90 top
IMU1  280.67,134.62 270 top
LED1  153.67,7.62 0 top
LED2  165.1,7.62 0 top
LED3  176.53,7.62 0 top
LED4  187.96,7.62 0 top
LED5  199.39,7.62 0 top
LED6  210.82,7.62 0 top
LED7  222.25,7.62 0 top
LED8  233.68,7.62 0 top
LED9  245.11,7.62 0 top
OPTO1  151.13,177.8 0 top
OPTO2  142.24,177.8 0 top
Q1  228.6,113.03 90 top
Q2  161.29,168.91 90 top
R1  246.38,140.97 0 top
R2  154.94,19.05 270 top
R3  166.37,19.05 270 top
R4  177.8,19.05 270 top
R5  176.53,198.12 0 top
R6  31.75,171.45 270 top
R7  35.56,171.45 270 top
R8  39.37,171.45 270 top
R9  43.18,171.45 270 top
R10  46.99,171.45 270 top
R11  50.8,171.45 270 top
R12  54.61,171.45 270 top
R13  58.42,171.45 270 top
R14  62.23,171.45 90 top
R15  66.04,171.45 90 top
R16  128.27,177.8 270 top
R17  147.32,165.1 90 top
R18  138.43,165.1 90 top
R19  189.23,19.05 270 top
R20  200.66,19.05 270 top
R21  212.09,19.05 270 top
R22  223.52,19.05 270 top
R23  234.95,19.05 270 top
R24  246.38,19.05 270 top
S1  246.38,147.32 0 top
S2  162.56,196.85 0 top
U$2  [STAND-OFF]  144.02,92.08 0 top
U$3  [STAND-OFF]  144.02,6.35 0 top
U$4  [STAND-OFF]  254.51,92.08 0 top
U$5  [STAND-OFF]  254.51,6.35 0 top
U$6  [STAND-OFF]  7.11,69.85 0 top
U$7  [STAND-OFF]  101.85,69.85 0 top
U$8  [STAND-OFF]  7.11,3.81 0 top
U$9  [STAND-OFF]  101.85,3.81 0 top
U$15  [STAND-OFF]  297.18,189.23 0 top
U$16  [STAND-OFF]  259.08,189.23 0 top
U$17  [STAND-OFF]  280.67,157.48 0 top
U$18  [STAND-OFF]  280.67,111.76 0 top
U$19  [STAND-OFF]  218.44,194.31 0 top
U$20  [STAND-OFF]  245.11,194.31 0 top
U$21  [STAND-OFF]  205.74,166.37 0 top
U$22  [STAND-OFF]  205.74,128.27 0 top
UART1  218.44,147.32 0 top
XBEE1  279.4,173.35 0 top

### Tracks (layer width: path | path; a pad name or v marks a point on that pad's centre or on a via)
3.3V  (via drill 0.6, 1)
  Top 1.27: IMU1.3.3V 273.05,115.57 270.51,113.03 CON11.2 | R5.2 180.34,196.85 177.8,196.85 176.53,195.58 176.53,180.34 175.26,179.07 AVR2.7 | R11.2 R10.2 R9.2 R8.2 R7.2 R6.2 31.75,142.29 CON3.1 | R12.2 R13.2 | v128.27,135.89 R16.2 132.08,172.72 133.35,173.99 v133.35,177.8 | v156.21,180.34 166.37,180.34 C7.1
  Top 3.556: CON1.12 90.17,91.44 102.87,91.44 v102.87,90.17 v102.87,92.71 v102.87,95.25 | CON5.1 CON6.1 74.24,191.19 74.93,190.5 74.93,142.24 78.74,138.43 83.52,138.43 CON1.13
  Bottom 1.27: IMU1.3.3V C5.2 266.7,125.73 R1.2 | C4.1 AVR1.7 243.84,120.65 246.38,123.19 246.38,137.16 247.65,138.43 250.19,138.43 251.46,139.7 R1.2 | XBEE1.1 268.08,193.04 265.43,193.04 264.16,191.77 C6.1 252.73,181.61 250.19,179.07 | R1.2 251.46,142.24 252.73,143.51 252.73,176.53 250.19,179.07 | 250.19,179.07 C1.2 243.84,180.34 242.57,181.61 240.03,181.61 GPS1.3.3V 238.76,181.61 228.6,181.61 227.33,182.88 227.33,186.69 226.06,187.96 201.93,187.96 | C7.1 AVR2.7 | 201.93,187.96 201.93,196.85 200.66,198.12 R5.2 | 201.93,187.96 CON12.2 | R11.2 R12.2 | 101.85,134.37 126.75,134.37 v128.27,135.89 | v133.35,177.8 153.67,177.8 v156.21,180.34
  Bottom 3.556: CON3.1 CON3.11 | CON3.1 32.05,142.24 78.74,142.24 82.42,138.56 CON1.13 CON1.1 CON1.2 101.85,134.37 102.87,133.35 v102.87,95.25 v102.87,92.71 v102.87,90.17 | CON3.1 CON3.2
5V
  Top 3.556: CON3.4 35.56,129.54 36.83,128.27 36.83,122.17 35.81,121.16 CON3.6 | CON13.1 CON13.2 CON13.3 CON13.4 5.46,190.88 5.08,190.5 5.08,110.49 7.62,107.95 25.78,107.95 CON3.19 | CON1.6 92.2,117.6 93.98,119.38 93.98,124.46 93.34,125.09 | 93.34,125.09 92.71,125.73 89.41,125.73 CON1.4 | CON7.1 CON8.1 92.02,191.19 92.71,190.5 92.71,143.51 93.98,142.24 93.98,125.73 93.34,125.09
  Bottom 3.556: CON3.6 37.59,121.16 38.1,120.65 38.1,96.52 | 38.1,96.52 36.83,95.25 21.59,95.25 20.32,96.52 20.32,101.6 22.86,104.14 26.16,104.14 CON3.20 CON3.19 | CON1.21 CON1.22 CON1.23 80.01,96.65 | 80.01,96.65 38.23,96.65 38.1,96.52 | CON1.6 93.22,117.6 93.98,116.84 93.98,85.09 92.71,83.82 81.28,83.82 80.01,85.09 80.01,96.65
5VSB  (via drill 0.6)
  Top 1.27: CON3.9 43.81,108.58 v44.45,107.95 | v80.01,107.95 81.03,107.95 81.79,107.19 87,107.19 CON1.9
  Bottom 1.27: v44.45,107.95 v80.01,107.95
12V  (via drill 1)
  Top 3.556: CON3.10 31.93,78.56 34.29,74.93 107.95,74.93 109.22,77.47 109.22,93.98 111.76,96.52 CON2.4 CON2.3 116.28,100.84 CON1.10 CON1.11 | CON10.1 CON9.1 | CON9.1 CON4.1 | CON9.1 111.18,191.19 110.49,190.5 v110.49,127 v110.49,124.46 v110.49,121.92
  Bottom 3.556: CON2.4 110.49,96.52 v110.49,121.92 v110.49,124.46 v110.49,127
-5V  (via drill 0.6)
  Top 0.508: CON3.18 26.92,112.78 29.21,110.49 v44.45,110.49
  Bottom 0.508: v44.45,110.49 82.37,110.49 CON1.20
-12V  (via drill 0.6)
  Top 0.508: CON3.12 27.43,137.92 29.21,139.7 34.29,139.7 35.56,138.43 v35.56,135.89
  Bottom 0.508: v35.56,135.89 36.83,134.62 83.39,134.62 CON1.14
AUDIO_GND  (via drill 0.6)
  Top 0.508: v63.5,26.67 72.39,17.78 72.39,8.89 73.66,7.62 78.74,7.62 80.01,6.35 | AUD1.1 80.01,6.35 | 80.01,6.35 81.28,7.62 91.44,7.62 92.71,6.35 AUD2.1
  Bottom 0.508: v63.5,26.67 11.43,78.74 8.51,78.74 CON18.5
BRAKE_SW
  Top 0.508: R16.1 128.27,189.23 129.54,190.5 132.03,190.5 CON15.1
  Bottom 0.508: AVR2.14 172.72,154.94 171.45,153.67 132.08,153.67 130.81,154.94 130.81,181.61 129.54,182.88 R16.1
BRAKES  (via drill 0.6)
  Top 0.508: AVR2.12 171.45,166.37 168.91,163.83 168.91,60.96 166.37,58.42 24.13,58.42 21.59,60.96 21.59,90.17 19.05,92.71 v10.79,92.71 | v10.79,113.03 10.79,117.47 13.97,120.65 13.97,176.53 16.51,179.07 26.67,179.07 28.7,181.1 28.7,188.85 CON13.6
  Bottom 0.508: v10.79,92.71 v10.79,113.03
BRAKES_LED
  Bottom 0.508: AVR1.12 238.76,107.95 237.49,106.68 237.49,40.64 234.95,38.1 199.39,38.1 198.12,36.83 LED5.A
GND  (via drill 0.6, 1)
  Top 1.27: C2.1 229.87,105.41 232.41,107.95 v232.41,116.84 | S1.3 241.02,145.06 240.03,146.05 240.03,172.72 GPS1.GND | AVR1.22 257.81,120.65 259.08,121.92 | 259.08,121.92 265.43,128.27 C5.1 | v252.73,137.16 255.27,139.7 255.27,143.51 254,144.78 249.91,144.78 S1.4 | C1.1 v257.81,176.53 | 259.08,121.92 v261.62,119.38 | C8.1 162.56,175.26 163.83,173.99 163.83,166.37 162.56,165.1 C9.1 162.56,158.75 161.29,157.48 152.4,157.48 151.13,158.75 151.13,166.37 | AVR2.8 176.53,176.53 179.07,179.07 AVR2.22 195.58,179.07 196.85,180.34 196.85,187.96 198.12,189.23 203.2,189.23 204.47,187.96 CON12.4 | 142.24,167.64 OPTO2.2 | 142.24,167.64 144.78,165.1 149.86,165.1 151.13,166.37 | 151.13,166.37 OPTO1.2 | CON15.2 134.37,185.67 135.89,184.15 135.89,167.64 137.16,166.37 140.97,166.37 142.24,167.64 | R20.1 R19.1 | R4.1 R3.1
  Top 3.556: CON3.7 45.85,116.97 v46.99,118.11 v46.99,120.65 v46.99,123.19 v46.99,125.73 | CON1.7 120.27,113.41 121.92,111.76 CON2.1 CON2.2 | CON1.24 80.26,92.46 78.74,93.98 78.74,101.6 69.85,110.49 v69.85,118.11 | v69.85,118.11 v72.39,118.11 | v67.31,118.11 v69.85,118.11
  Top 6.35: v67.31,161.29 v67.31,125.73 v67.31,123.19 v67.31,120.65 v67.31,118.11
  Bottom 1.27: R3.1 R2.1 | R19.1 R4.1 | R20.1 R21.1 R22.1 R23.1 R24.1 266.7,24.13 273.05,30.48 273.05,85.09 276.86,88.9 285.75,88.9 289.56,92.71 289.56,96.52 287.02,99.06 CON11.10 CON11.8 CON11.6 CON11.4 273.05,107.95 v261.62,119.38 | C5.1 IMU1.GND | C1.1 243.84,175.26 242.57,173.99 240.03,173.99 GPS1.GND 238.76,172.72 232.41,172.72 231.14,171.45 220.98,171.45 218.44,173.99 218.44,182.88 215.9,185.42 CON12.10 CON12.8 CON12.6 CON12.4 | 264.16,176.53 C6.2 | 264.16,176.53 264.16,175.26 268.31,175.26 XBEE1.10 | C3.1 230.5,121.28 233.68,118.11 | 233.68,118.11 C4.2 AVR1.8 245.11,118.11 247.65,120.65 AVR1.22 251.46,120.65 252.73,121.92 v252.73,137.16 | 233.68,118.11 v232.41,116.84 | S1.3 S1.4 | v257.81,176.53 264.16,176.53 | AVR2.8 C7.2 163.19,176.53 C8.1 162.56,179.07 166.37,182.88 166.37,194.03 S2.4 S2.3 | CON14.11 CON14.12 61.52,185.67 CON6.2 | CON4.2 CON15.2
  Bottom 3.556: CON3.3 CON3.13 16.89,133.73 | CON3.5 CON3.15 CON3.16 CON3.17 | CON3.7 CON3.17 | CON13.10 CON13.9 CON13.8 CON13.7 9.73,185.42 6.35,185.42 5.08,184.15 5.08,134.62 5.97,133.73 16.89,133.73 | 16.89,133.73 16.51,133.35 16.51,118.11 17.78,116.84 26.29,116.84 CON3.17 | CON1.5 CON1.17 CON1.18 | CON1.18 CON1.19 CON1.7 | CON1.18 81.79,117.6 78.74,120.65 | 78.74,120.65 78.74,129.54 80.01,130.81 83.01,130.81 CON1.15 CON1.3 | 78.74,120.65 76.2,118.11 v72.39,118.11 v69.85,118.11 v67.31,118.11 v46.99,118.11 v46.99,120.65 v46.99,123.19 46.99,124.97 46.74,125.22 32,125.22
  Bottom 6.35: CON4.2 CON9.2 CON10.2 CON7.2 CON8.2 CON5.2 CON6.2 72.14,185.67 74.93,182.88 74.93,161.29 v67.31,161.29
GPS_LOCK_LED  (via drill 0.6)
  Top 0.508: v200.66,33.02 v189.23,33.02
  Bottom 0.508: AVR1.14 242.57,38.1 237.49,33.02 v200.66,33.02 | v189.23,33.02 176.53,33.02 175.26,31.75 LED3.A
GPS_TO_UART  (via drill 0.6)
  Top 0.508: v238.76,144.78 238.76,170.18 237.49,171.45 237.49,175.26 238.76,175.26 GPS1.TX
  Bottom 0.508: UART1.CN2-10 213.36,139.7 215.9,142.24 236.22,142.24 v238.76,144.78
HEAD_LEFT
  Bottom 0.508: AUD1.5 85.09,15.24 12.7,87.63 CON18.1
HEAD_RIGHT
  Bottom 0.508: CON18.2 12.16,85.63 71.12,26.67 71.12,10.16 AUD1.2
HEADS  (via drill 0.6)
  Top 0.508: AVR2.13 171.45,163.83 170.18,162.56 170.18,59.69 167.64,57.15 22.86,57.15 20.32,59.69 20.32,88.9 17.78,91.44 v8.89,91.44 | v8.89,113.03 8.89,118.11 12.7,121.92 12.7,177.8 15.24,180.34 23.37,180.34 24.38,181.36 24.38,188.72 CON13.5
  Bottom 0.508: v8.89,91.44 v8.89,113.03
HEADS_LED  (via drill 0.6)
  Top 0.508: v200.66,35.56 187.96,35.56 186.69,34.29 LED4.A
  Bottom 0.508: AVR1.13 241.3,105.41 240.03,104.14 240.03,39.37 236.22,35.56 v200.66,35.56
HORN_LED  (via drill 0.6)
  Top 0.508: LED9.A 243.84,83.82 242.57,85.09 212.09,85.09 v210.82,86.36
  Bottom 0.508: AVR1.4 212.09,128.27 210.82,127 v210.82,86.36
IMU_COMM_LED  (via drill 0.6)
  Top 0.508: v200.66,30.48 v189.23,30.48 | v177.8,30.48 153.67,30.48 152.4,29.21 LED1.A
  Bottom 0.508: AVR1.16 247.65,105.41 246.38,104.14 246.38,36.83 240.03,30.48 v200.66,30.48 | v189.23,30.48 v177.8,30.48
IMU_MISO  (via drill 0.6)
  Top 0.508: v261.62,92.71 v261.62,105.41
  Bottom 0.508: CON11.9 280.67,92.71 279.4,91.44 262.89,91.44 v261.62,92.71 | v261.62,105.41 256.54,110.49 AVR1.18
IMU_MOSI
  Bottom 0.508: CON11.1 267.97,96.52 256.54,107.95 AVR1.17
IMU_RST
  Top 0.508: R1.1 241.3,137.16 AVR1.1 | CON11.5 275.59,92.71 278.13,90.17 285.75,90.17 288.29,92.71 288.29,111.76 290.83,114.3 290.83,152.4 289.56,153.67 253.72,153.67 S1.2
  Bottom 0.508: S1.2 S1.1 241.3,147.75 R1.1
IMU_SCK  (via drill 0.6)
  Top 0.508: v262.89,93.98 v262.89,106.68
  Bottom 0.508: CON11.7 278.13,93.98 276.86,92.71 264.16,92.71 v262.89,93.98 | v262.89,106.68 256.54,113.03 AVR1.19
IMU_TO_UART
  Bottom 0.508: AVR1.3 224.79,130.81 223.52,132.08 UART1.CN2-17
LEFT_BOT_BUT
  Bottom 0.508: AVR2.26 190.5,189.23 191.77,187.96 191.77,144.78 190.5,143.51 101.6,143.51 95.25,149.86 54.61,149.86 48.26,156.21 39.62,156.21 37.59,158.24 37.59,175.51 38.61,176.53 R8.1 39.37,179.07 42.42,182.12 42.42,187.2 43.43,188.21 45.97,188.21 CON14.3
LEFT_MID_BUT
  Bottom 0.508: AVR2.27 191.77,191.77 193.04,190.5 193.04,143.51 191.77,142.24 100.33,142.24 93.98,148.59 53.34,148.59 46.99,154.94 35.81,154.94 33.78,156.97 33.78,175.26 35.05,176.53 R7.1 35.56,181.61 36.83,182.88 36.83,186.69 38.1,187.96 41.53,187.96 CON14.2
LEFT_PADDLE  (via drill 0.6)
  Top 0.508: v62.23,156.21 42.93,156.21 v41.4,157.73
  Bottom 0.508: CON14.4 50.67,188.72 48.51,188.72 46.48,186.69 46.48,183.39 43.18,180.09 R9.1 42.93,176.78 42.16,176.78 41.4,176.02 v41.4,157.73 | AVR2.16 182.88,163.83 184.15,162.56 184.15,149.86 182.88,148.59 106.68,148.59 100.33,154.94 63.5,154.94 v62.23,156.21
LEFT_TOP_BUT
  Bottom 0.508: AVR2.28 193.04,194.31 194.31,193.04 194.31,142.24 193.04,140.97 99.06,140.97 92.71,147.32 52.07,147.32 45.72,153.67 30.48,153.67 27.94,156.21 27.94,173.99 30.48,176.53 R6.1 31.75,180.34 34.29,182.88 34.29,189.23 35.56,190.5 39.88,190.5 CON14.1
LEFT_WHEEL_LED
  Top 0.508: AVR2.5 157.48,184.15 156.21,185.42 156.21,193.04 154.94,194.31 67.31,194.31 66.04,193.04 66.04,184.15 69.85,180.34 69.85,170.18 68.58,168.91 63.5,168.91 62.23,167.64 R14.1
LTS_MISO  (via drill 0.6)
  Top 0.508: AVR2.18 181.61,168.91 185.42,172.72 209.55,172.72 212.09,175.26 CON12.9 | v147.32,152.4 R17.1
  Bottom 0.508: AVR2.18 177.8,168.91 176.53,167.64 176.53,153.67 175.26,152.4 v147.32,152.4
LTS_MOSI  (via drill 0.6)
  Top 0.508: AVR2.17 181.61,166.37 185.42,170.18 v200.66,170.18 | v201.93,177.8 CON12.1 | v138.43,152.4 R18.1
  Bottom 0.508: v200.66,170.18 201.93,171.45 v201.93,177.8 | AVR2.17 179.07,166.37 177.8,165.1 177.8,152.4 176.53,151.13 139.7,151.13 v138.43,152.4
LTS_RST
  Bottom 0.508: S2.1 S2.2 170.46,199.11 R5.1 171.45,195.58 AVR2.1 173.99,194.31 176.53,196.6 181.61,196.6 182.88,195.58 198.12,195.58 199.39,194.31 199.39,181.61 200.66,180.34 205.74,180.34 207.01,181.61 CON12.5
LTS_SCK
  Top 0.508: AVR2.19 181.61,171.45 185.42,175.26 207.01,175.26 209.55,177.8 CON12.7
LTS_TO_UART  (via drill 0.6)
  Top 0.508: UART1.CN3-16 220.98,161.29 219.71,162.56 v201.93,162.56 | v196.85,162.56 187.96,162.56 v186.69,163.83 | v186.69,182.88 186.69,190.5 v178.31,190.5
  Bottom 0.508: v196.85,162.56 v201.93,162.56 | v186.69,163.83 v186.69,182.88 | v178.31,190.5 175.26,190.5 173.99,189.23 AVR2.3
LTURN  (via drill 0.6)
  Top 0.508: AVR2.11 171.45,168.91 167.64,165.1 167.64,62.23 165.1,59.69 25.4,59.69 22.86,62.23 22.86,91.44 20.32,93.98 v12.7,93.98 | v12.7,113.03 12.7,116.84 15.24,119.38 15.24,173.99 17.78,176.53 v26.67,176.53
  Bottom 0.508: v12.7,93.98 v12.7,113.03 | v26.67,176.53 26.67,185.24 CON13.11
LTURN_LED  (via drill 0.6)
  Top 0.508: LED6.A 209.55,39.37 v210.82,40.64
  Bottom 0.508: AVR1.11 236.22,110.49 234.95,109.22 234.95,41.91 233.68,40.64 v210.82,40.64
MIC_LEFT  (via drill 0.6)
  Top 0.508: AUD2.5 97.71,14.05 91.44,20.32 74.93,20.32 v68.58,26.67
  Bottom 0.508: v68.58,26.67 11.43,83.82 7.62,83.82 CON18.3
MIC_RIGHT  (via drill 0.6)
  Top 0.508: AUD2.2 87.71,16.43 85.09,19.05 73.66,19.05 v66.04,26.67
  Bottom 0.508: v66.04,26.67 11.43,81.28 7.97,81.28 CON18.4
N$1
  Top 0.508: R14.2 58.42,180.34 54.61,180.34 53.34,181.61 49.53,181.61 48.26,182.88 48.26,184.99 CON14.9
N$2
  Bottom 0.508: AVR1.9 Q1.2 227.33,116.84 C3.2
N$3
  Bottom 0.508: AVR1.10 232.41,113.03 229.87,110.49 Q1.1 227.33,109.22 C2.2
N$4
  Top 0.508: AVR1.28 256.54,135.89 264.16,143.51 IMU1.AX
N$5
  Top 0.508: AVR1.27 256.54,133.35 264.16,140.97 IMU1.AY
N$6
  Top 0.508: AVR1.26 256.54,130.81 264.16,138.43 IMU1.AZ
N$7
  Top 0.508: AVR1.25 256.54,128.27 264.16,135.89 IMU1.GZ4
N$8
  Top 0.508: AVR1.24 256.54,125.73 264.16,133.35 IMU1.GX4
N$9
  Top 0.508: AVR1.23 256.54,123.19 264.16,130.81 IMU1.GY4
N$10
  Bottom 0.508: C8.2 160.02,172.72 Q2.2 163.83,173.99 AVR2.9
N$11
  Bottom 0.508: C9.2 160.02,165.1 Q2.1 161.29,167.64 165.1,171.45 AVR2.10
N$12
  Bottom 0.508: LED3.K R4.2
N$13
  Bottom 0.508: LED2.K R3.2
N$14
  Bottom 0.508: LED1.K R2.2
N$15
  Top 0.508: R15.2 60.96,181.61 55.88,181.61 53.34,184.15 53.34,184.86 CON14.10
N$16
  Bottom 0.508: R17.2 147.32,172.72 OPTO1.1
N$17
  Bottom 0.508: R18.2 138.43,172.72 OPTO2.1
N$18
  Bottom 1.27: OPTO1.4 147.32,182.88 147.32,189.23 148.59,190.5 149.81,190.5 CON16.1
N$19
  Bottom 1.27: CON16.2 150.88,185.67 151.13,185.42 OPTO1.3
N$20
  Bottom 1.27: OPTO2.4 138.43,182.88 138.43,189.23 139.7,190.5 140.92,190.5 CON17.1
N$21
  Bottom 1.27: CON17.2 141.99,185.67 142.24,185.42 OPTO2.3
N$22
  Bottom 0.508: LED4.K R19.2
N$23
  Bottom 0.508: LED5.K R20.2
N$24
  Bottom 0.508: LED6.K R21.2
N$25
  Bottom 0.508: LED7.K R22.2
N$26
  Bottom 0.508: LED8.K R23.2
N$27
  Bottom 0.508: LED9.K R24.2
N$28  (1 unrouted)
N$29
  Top 0.508: UART1.CN2-11 215.9,133.35 217.17,132.08 227.33,132.08 228.6,133.35 | 228.6,133.35 UART1.CN2-21 | 228.6,133.35 229.87,132.08 234.95,132.08 236.22,133.35 236.22,161.29 234.95,162.56 229.87,162.56 228.6,161.29 UART1.CN3-22
  Bottom 0.508: UART1.CN2-1 UART1.CN2-3 UART1.CN2-5 208.28,133.35 209.55,132.08 214.63,132.08 215.9,133.35 UART1.CN2-11 | UART1.CN3-22 228.6,161.29 227.33,162.56 217.17,162.56 215.9,161.29 UART1.CN3-12
N$30  (via drill 1)
  other vias: 68.83,159.77
N$31  (via drill 1)
  other vias: 68.83,162.81
N$32  (via drill 1)
  other vias: 65.79,162.81
N$33  (via drill 1)
  other vias: 65.79,159.77
PS_ON  (via drill 0.6)
  Top 0.508: CON3.14 26.67,129.54 29.21,132.08 29.21,134.62 30.48,135.89 33.02,135.89 v35.56,133.35 | v77.47,133.35 78.74,133.35 80.01,132.08 80.01,127 81.28,125.73 83.39,125.73 CON1.16
  Bottom 0.508: v35.56,133.35 v77.47,133.35
PWR_OK  (via drill 0.6)
  Top 0.508: CON3.8 v44.7,112.78 | v73.66,111.76 82.3,111.76 82.55,111.51 86.87,111.51 CON1.8
  Bottom 0.508: v44.7,112.78 72.64,112.78 v73.66,111.76
RIGHT_BOT_BUT  (via drill 0.6)
  Top 0.508: 53.34,176.53 R12.1 | 53.34,176.53 50.8,179.07 40.64,179.07 39.37,180.34 39.37,184.48 CON14.7 | v52.83,162.05 52.83,176.02 53.34,176.53
  Bottom 0.508: AVR2.23 184.15,181.61 185.42,180.34 185.42,148.59 184.15,147.32 105.41,147.32 99.06,153.67 61.21,153.67 v52.83,162.05
RIGHT_MID_BUT
  Bottom 0.508: AVR2.24 187.96,184.15 189.23,182.88 189.23,147.32 187.96,146.05 104.14,146.05 97.79,152.4 58.42,152.4 49.02,161.8 49.02,175.51 50.04,176.53 R11.1 50.8,177.8 54.61,181.61 54.61,181.86 54.86,182.12 54.86,186.69 56.39,188.21 58.55,188.21 CON14.6
RIGHT_PADDLE
  Top 0.508: R13.1 55.88,179.07 53.34,179.07 52.07,180.34 45.72,180.34 44.45,181.61 CON14.8
  Bottom 0.508: AVR2.15 181.61,161.29 182.88,160.02 182.88,151.13 181.61,149.86 107.95,149.86 101.6,156.21 64.77,156.21 60.96,160.02 58.42,160.02 56.64,161.8 56.64,174.75 R13.1
RIGHT_TOP_BUT
  Bottom 0.508: AVR2.25 189.23,186.69 190.5,185.42 190.5,146.05 189.23,144.78 102.87,144.78 96.52,151.13 55.88,151.13 49.53,157.48 46.99,157.48 45.21,159.26 45.21,175.51 46.23,176.53 R10.1 46.99,179.07 50.8,182.88 50.8,187.2 51.82,188.21 54.36,188.21 CON14.5
RIGHT_WHEEL_LED  (via drill 0.6)
  Top 0.508: AVR2.4 158.75,186.69 157.48,187.96 157.48,194.31 156.21,195.58 66.04,195.58 64.77,194.31 64.77,181.61 v67.31,179.07
  Bottom 0.508: v67.31,179.07 68.58,177.8 68.58,173.99 66.04,171.45 R15.1
RTURN  (via drill 0.6)
  Top 0.508: AVR2.6 171.45,181.61 170.18,180.34 170.18,170.18 166.37,166.37 166.37,63.5 163.83,60.96 26.67,60.96 24.13,63.5 24.13,92.71 21.59,95.25 v14.61,95.25 | v14.61,113.03 14.61,116.2 16.51,118.11 16.51,171.45 19.05,173.99 27.94,173.99 29.21,175.26 29.21,179.07 30.48,180.34 30.48,185.12 CON13.12
  Bottom 0.508: v14.61,95.25 v14.61,113.03
RTURN_LED  (via drill 0.6)
  Top 0.508: LED7.A 220.98,76.2 219.71,77.47 217.17,77.47 v215.9,78.74
  Bottom 0.508: AVR1.6 217.17,123.19 215.9,121.92 v215.9,78.74
STARTER_LED  (via drill 0.6)
  Top 0.508: LED8.A 232.41,80.01 231.14,81.28 214.63,81.28 v213.36,82.55
  Bottom 0.508: AVR1.5 214.63,125.73 213.36,124.46 v213.36,82.55
UART_TO_GPS  (via drill 0.6)
  Top 0.508: UART1.CN2-7 210.82,133.35 209.55,132.08 201.93,132.08 200.66,133.35 200.66,138.43 201.93,139.7 210.82,139.7 v215.9,144.78 | v237.49,146.05 237.49,168.91 236.22,170.18 236.22,176.53 237.49,177.8 238.76,177.8 GPS1.RX
  Bottom 0.508: v215.9,144.78 236.22,144.78 v237.49,146.05
UART_TO_IMU
  Bottom 0.508: AVR1.2 241.3,133.35 234.95,139.7 224.79,139.7 223.52,138.43 UART1.CN2-18
UART_TO_LTS  (via drill 0.6)
  Top 0.508: AVR2.2 171.45,191.77 170.18,193.04 170.18,199.39 171.45,200.66 186.69,200.66 187.96,199.39 v187.96,181.61 | v187.96,167.64 198.12,167.64 199.39,166.37 199.39,156.21 200.66,154.94 222.25,154.94 223.52,156.21 UART1.CN3-17
  Bottom 0.508: v187.96,167.64 v187.96,181.61
UART_TO_XBEE  (via drill 0.6)
  Top 0.508: XBEE1.3 270.38,189.35 271.78,187.96 271.78,161.29 270.51,160.02 v246.38,160.02
  Bottom 0.508: UART1.CN3-26 v246.38,160.02
XBEE_COMM_LED  (via drill 0.6)
  Top 0.508: AVR1.15 250.19,101.6 248.92,100.33 209.55,100.33 208.28,99.06 208.28,43.18 207.01,41.91 165.1,41.91 v163.83,40.64 | v163.83,27.94 LED2.A
  Bottom 0.508: v163.83,40.64 v163.83,27.94
XBEE_TO_UART  (via drill 0.6)
  Top 0.508: XBEE1.2 270.93,191.35 273.05,189.23 273.05,160.02 271.78,158.75 247.65,158.75 v246.38,157.48
  Bottom 0.508: UART1.CN3-25 v246.38,157.48
(copper drawn outside any net)
  shapes: Bottom area x22, Top area x4

### Text on the board
tPlace: Reset | Expansion PWR 3.3V | Expansion PWR 3.3V | Expansion PWR 5V | Expansion PWR 5V | Expansion PWR 12V | Expansion PWR 12V | Touchscreen PWR | Brake Switch | Lights | Steering Wheel | WARNING: Disconnect | starter and horn | Horn Driver | Starter Driver | before flashing! | Reset | 2/2/10 Rev A | Bob Somers | rsomers@calpoly.edu | CAL POLY | Supermileage Vehicle Team | URBAN CONCEPT | Motherboard Power Out | Sponsored by Advanced Circuits | Power Supply In | www.4pcb.com | P4 In | Front Panel | Audio | Pico-ITX Computer | ATX Power Supply | Power | Switch | RS-232 | Phones | Mic | Port | IMU Comm | XBee Comm | GPS Lock | Headlights | Brakelights | Left Turn | Right Turn | Starter | Horn | USB Ports